# EasyEDA Pro project MultiEffect.eprj

# Schematic BaseBoard
Board Name: BaseBoard; Create Date: 2026-01-03; Page Name: Shematic; Project Name: MultiEffect; Schematic Name: BaseBoard; Update Date: 2026-01-04; Add into BOM: yes; Convert to PCB: yes; Date: 2023-09-30; REV: 1.0; Sheet: 1/1; spicePre: .
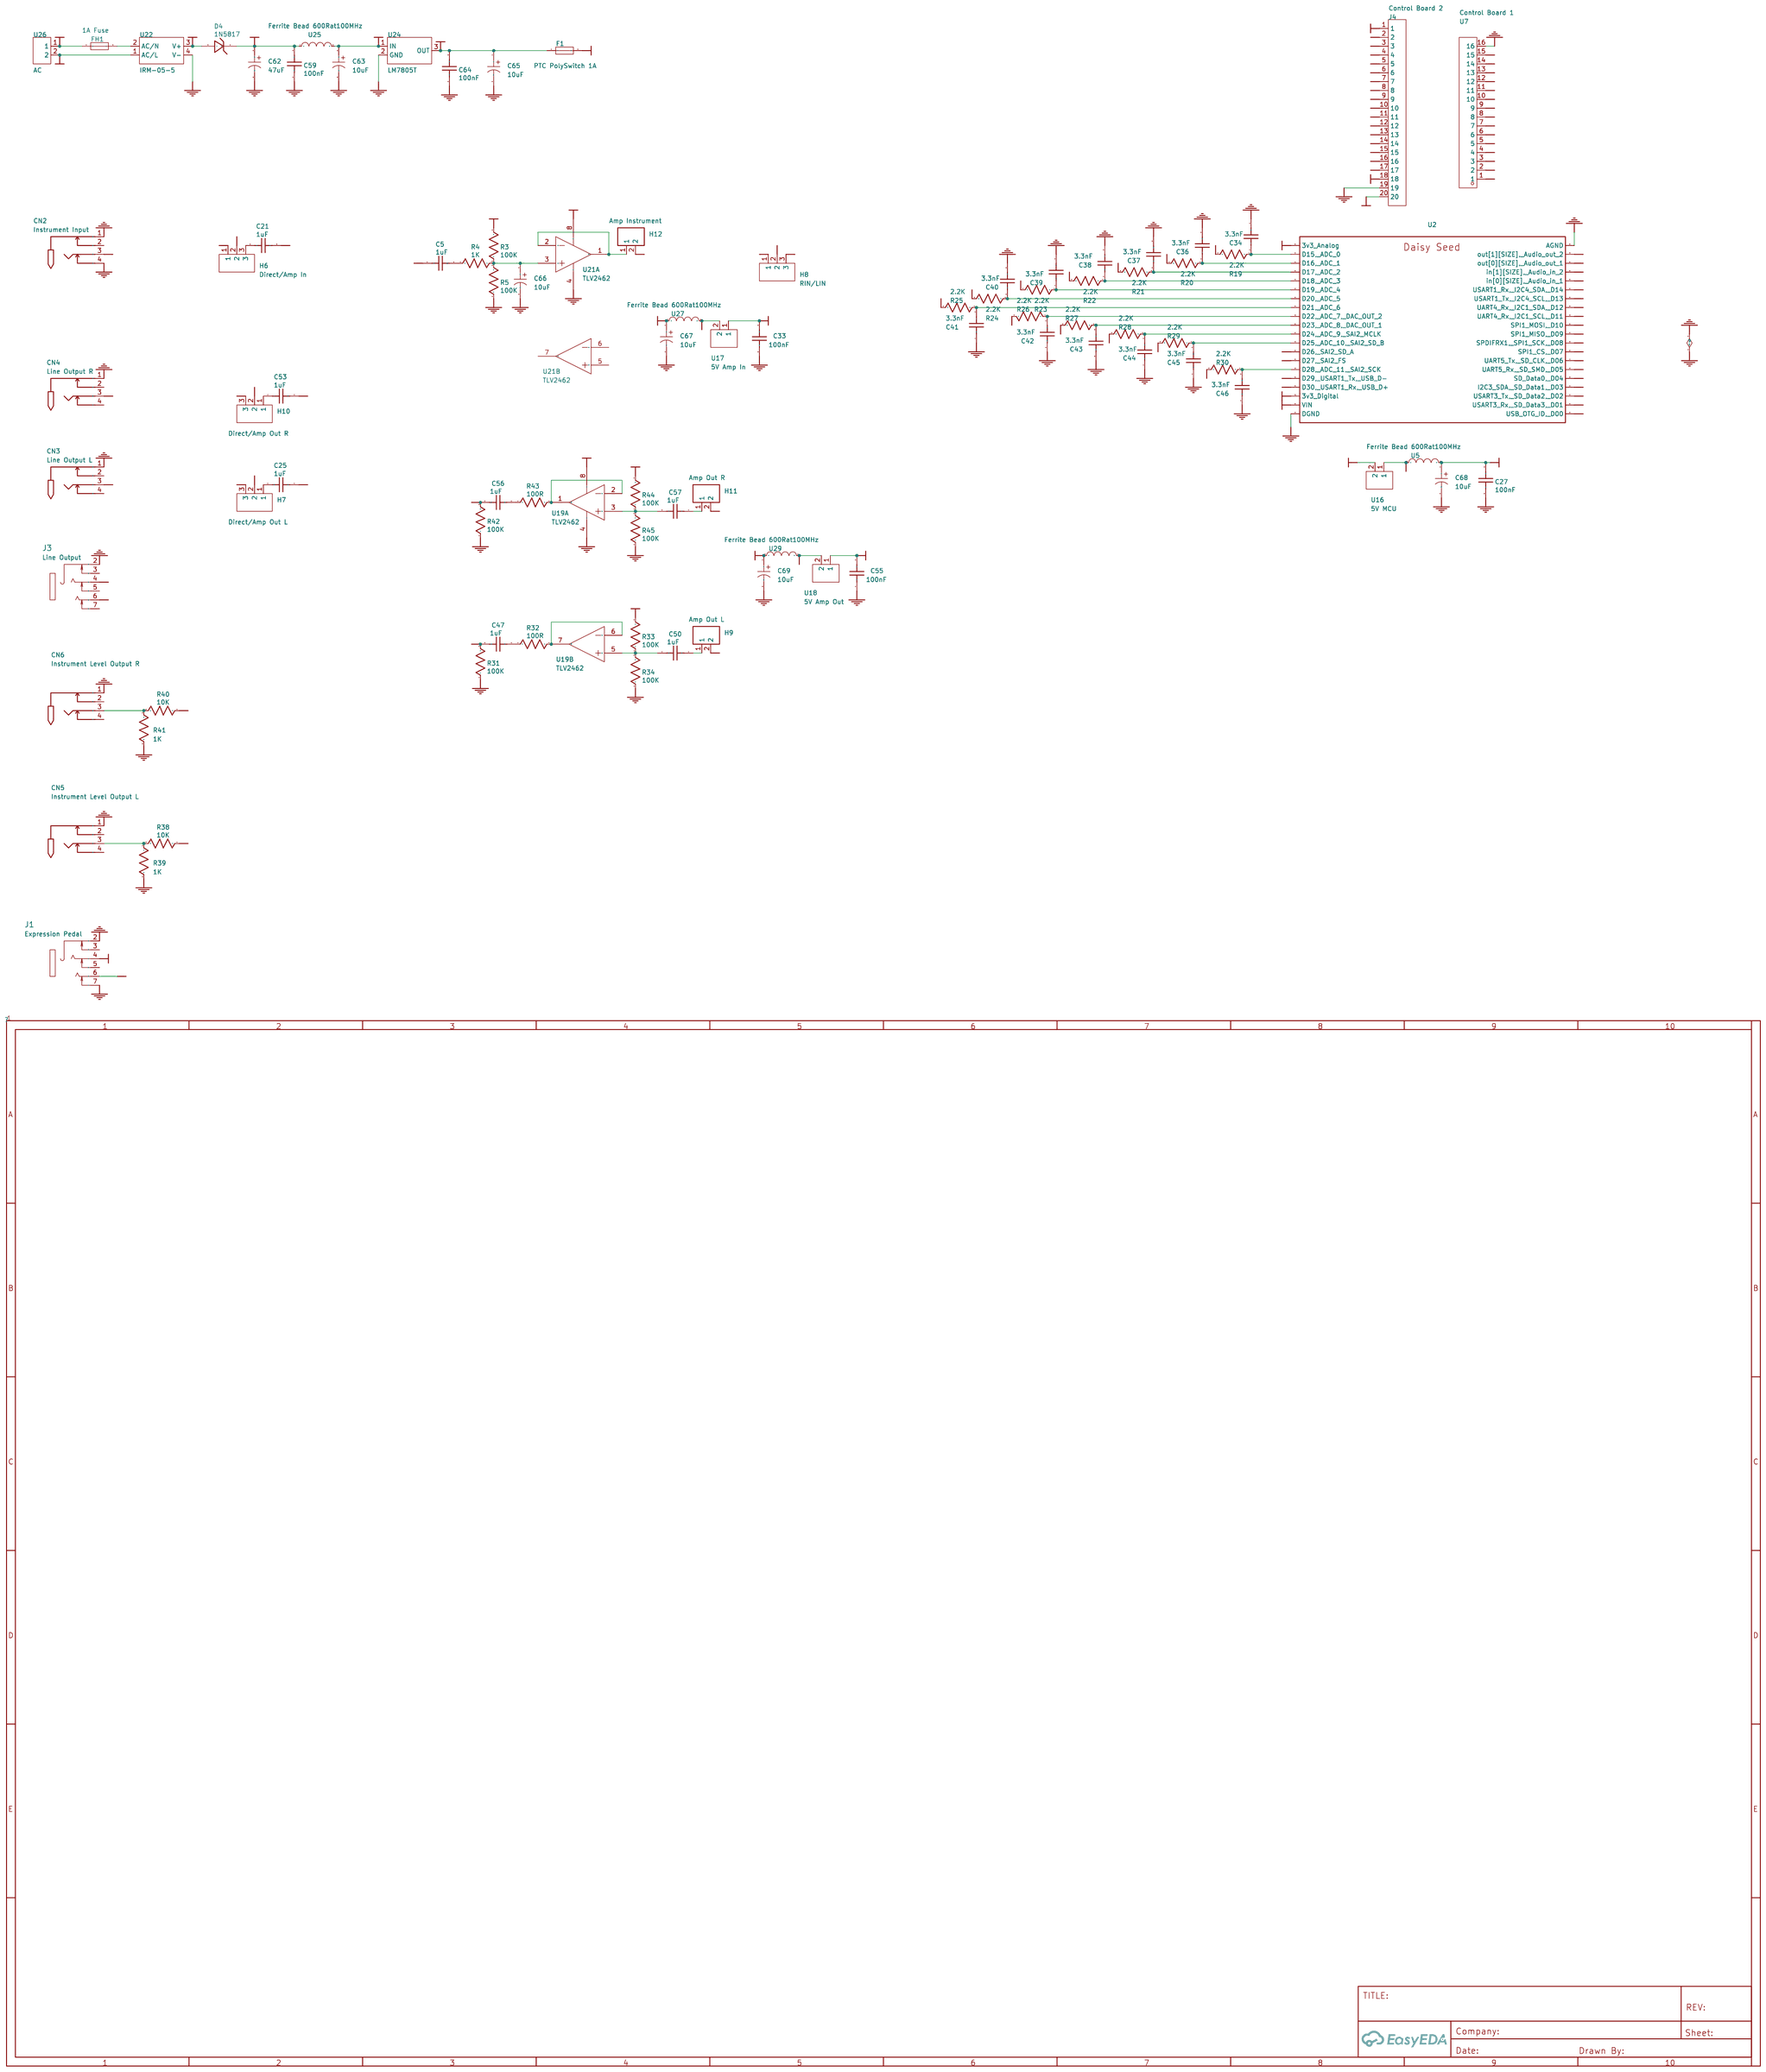
[diagram p0: schematic sheet]

## Parts
C5  1uF  [CAP-TH_L8.0-W4.0-P5.00-D0.7]
C21  1uF  [CAP-TH_L8.0-W4.0-P5.00-D0.7]
C25  1uF  [CAP-TH_L8.0-W4.0-P5.00-D0.7]
C27  100nF  [CAP-TH_L8.0-W4.0-P5.00-D0.7]
C33  100nF  [CAP-TH_L8.0-W4.0-P5.00-D0.7]
C34  3.3nF  [CAP-TH_L8.0-W4.0-P5.00-D0.7]
C36  3.3nF  [CAP-TH_L8.0-W4.0-P5.00-D0.7]
C37  3.3nF  [CAP-TH_L8.0-W4.0-P5.00-D0.7]
C38  3.3nF  [CAP-TH_L8.0-W4.0-P5.00-D0.7]
C39  3.3nF  [CAP-TH_L8.0-W4.0-P5.00-D0.7]
C40  3.3nF  [CAP-TH_L8.0-W4.0-P5.00-D0.7]
C41  3.3nF  [CAP-TH_L8.0-W4.0-P5.00-D0.7]
C42  3.3nF  [CAP-TH_L8.0-W4.0-P5.00-D0.7]
C43  3.3nF  [CAP-TH_L8.0-W4.0-P5.00-D0.7]
C44  3.3nF  [CAP-TH_L8.0-W4.0-P5.00-D0.7]
C45  3.3nF  [CAP-TH_L8.0-W4.0-P5.00-D0.7]
C46  3.3nF  [CAP-TH_L8.0-W4.0-P5.00-D0.7]
C47  1uF  [CAP-TH_L8.0-W4.0-P5.00-D0.7]
C50  1uF  [CAP-TH_L8.0-W4.0-P5.00-D0.7]
C53  1uF  [CAP-TH_L8.0-W4.0-P5.00-D0.7]
C55  100nF  [CAP-TH_L8.0-W4.0-P5.00-D0.7]
C56  1uF  [CAP-TH_L8.0-W4.0-P5.00-D0.7]
C57  1uF  [CAP-TH_L8.0-W4.0-P5.00-D0.7]
C59  100nF  [CAP-TH_L8.0-W4.0-P5.00-D0.7]
C62  47uF  [CAP-TH_BD5.0-P2.00-D0.5-FD]
C63  10uF  [CAP-TH_BD5.0-P2.00-D0.5-FD-1]
C64  100nF  [CAP-TH_L8.0-W4.0-P5.00-D0.7]
C65  10uF  [CAP-TH_BD5.0-P2.00-D0.5-FD-1]
C66  10uF  [CAP-TH_BD5.0-P2.00-D0.5-FD-1]
C67  10uF  [CAP-TH_BD5.0-P2.00-D0.5-FD-1]
C68  10uF  [CAP-TH_BD5.0-P2.00-D0.5-FD-1]
C69  10uF  [CAP-TH_BD5.0-P2.00-D0.5-FD-1]
CN2  Instrument Input  [AUDIO-TH_CK6.35-3-15-6]
CN3  Line Output L  [AUDIO-TH_CK6.35-3-15-6]
CN4  Line Output R  [AUDIO-TH_CK6.35-3-15-6]
CN5  Instrument Level Output L  [AUDIO-TH_CK6.35-3-15-6]
CN6  Instrument Level Output R  [AUDIO-TH_CK6.35-3-15-6]
D4  1N5817  [DO-41_BD2.4-L4.7-P8.70-D0.9-RD]
F1  PTC PolySwitch 1A  [FUSE-TH_BD2.1-L6.5_V0]
FH1  1A Fuse  [FUSE-TH_L24.8-W9.8-P22.60]
H6  Direct/Amp In  [HDR-TH_3P-P2.54-V-M-1]
H7  Direct/Amp Out L  [HDR-TH_3P-P2.54-V-M-1]
H8  RIN/LIN  [HDR-TH_3P-P2.54-V-M-1]
H9  Amp Out L  [HDR-TH_2P-P2.00-V-M]
H10  Direct/Amp Out R  [HDR-TH_3P-P2.54-V-M-1]
H11  Amp Out R  [HDR-TH_2P-P2.00-V-M]
H12  Amp Instrument  [HDR-TH_2P-P2.00-V-M]
J1  Expression Pedal  [AUDIO-TH_PJ-609BA]
J3  Line Output  [AUDIO-TH_PJ-609BA]
J4  Control Board 2  [HDR-TH_20P-P2.54-V-M-1]
R3  100K  [PS-RES-16.5*6.42]
R4  1K  [PS-RES-16.5*6.42]
R5  100K  [PS-RES-16.5*6.42]
R19  2.2K  [PS-RES-16.5*6.42]
R20  2.2K  [PS-RES-16.5*6.42]
R21  2.2K  [PS-RES-16.5*6.42]
R22  2.2K  [PS-RES-16.5*6.42]
R23  2.2K  [PS-RES-16.5*6.42]
R24  2.2K  [PS-RES-16.5*6.42]
R25  2.2K  [PS-RES-16.5*6.42]
R26  2.2K  [PS-RES-16.5*6.42]
R27  2.2K  [PS-RES-16.5*6.42]
R28  2.2K  [PS-RES-16.5*6.42]
R29  2.2K  [PS-RES-16.5*6.42]
R30  2.2K  [PS-RES-16.5*6.42]
R31  100K  [PS-RES-16.5*6.42]
R32  100R  [PS-RES-16.5*6.42]
R33  100K  [PS-RES-16.5*6.42]
R34  100K  [PS-RES-16.5*6.42]
R38  10K  [PS-RES-16.5*6.42]
R39  1K  [PS-RES-16.5*6.42]
R40  10K  [PS-RES-16.5*6.42]
R41  1K  [PS-RES-16.5*6.42]
R42  100K  [PS-RES-16.5*6.42]
R43  100R  [PS-RES-16.5*6.42]
R44  100K  [PS-RES-16.5*6.42]
R45  100K  [PS-RES-16.5*6.42]
U2  Daisy Seed  [DAISY_SEED]
U5  Ferrite Bead 600Rat100MHz  [IND-TH_BD3.5-L6.0-P10.00-D0.8]
U7  Control Board 1  [HDR-TH_16P-P2.54-V-M_1]
U16  5V MCU  [HDR-TH_2P-P2.54-V-M-1]
U17  5V Amp In  [HDR-TH_2P-P2.54-V-M-1]
U18  5V Amp Out  [HDR-TH_2P-P2.54-V-M-1]
U19  TLV2462  [PDIP-8_L9.5-W6.4-P2.54-LS7.6-BL]  (sections 1,2)
U21  TLV2462  [PDIP-8_L9.5-W6.4-P2.54-LS7.6-BL]  (sections 1,2)
U22  IRM-05-5  [PWRM-TH_IRM-05-5]
U24  LM7805T  [TO-220-3_L10.0-W4.5-P2.54-L-1]
U25  Ferrite Bead 600Rat100MHz  [IND-TH_BD3.5-L6.0-P10.00-D0.8]
U26  AC  [CONN-TH_P5.08_KF128-5.08-2P]
U27  Ferrite Bead 600Rat100MHz  [IND-TH_BD3.5-L6.0-P10.00-D0.8]
U29  Ferrite Bead 600Rat100MHz  [IND-TH_BD3.5-L6.0-P10.00-D0.8]

## Library data of the parts
C5 C21 C25 C34 C36-C47 C50 C53 C56 C57 = 1uF: Supplier: LCSC; Supplier Part: C249166; Manufacturer: STE(松田); Manufacturer Part: R08B1B102KN0B0S0N0; JLCPCB Part Class: Extended Part; link: https://lcsc.com/eda_search?q=C249166&%26type=1&ref=editor; nameAlias: Value; Contributor: LCSC; spicePre: C; spiceSymbolName: R08B1B102KN0B0S0N0
C27 C33 C55 C59 C64 = 100nF: Supplier: LCSC; Supplier Part: C249166; Manufacturer: STE(松田); Manufacturer Part: R08B1B102KN0B0S0N0; JLCPCB Part Class: Extended Part; link: https://lcsc.com/eda_search?q=C249166&%26type=1&ref=editor; nameAlias: Value; Contributor: LCSC; spicePre: C; spiceSymbolName: R08B1B102KN0B0S0N0
C62 = FH470M025C110A: LCSC Part Name: 47uF ±20% 25V; Supplier Part: C5129734; Manufacturer: CapXon(丰宾); Supplier Footprint: 插件,D5xL11mm; JLCPCB Part Class: Extended Part; Datasheet: https://item.szlcsc.com/datasheet/FH470M025C110A/5734982.html; Supplier: LCSC; Tolerance: ±20%; Voltage Rating: 25V; Diameter: 5mm; Height - Seated (Max): 11mm; Operating Temperature: -40℃~+105℃
C63 C65-C69 = RD1E106M05011BB180: LCSC Part Name: 10uF ±20% 25V; Supplier Part: C48783599; Manufacturer: SAMWHA(三和); Supplier Footprint: 插件; JLCPCB Part Class: Extended Part; Datasheet: https://item.szlcsc.com/datasheet/RD1E106M05011BB180/51081497.html; Supplier: LCSC; Tolerance: ±20%; Voltage Rating: 25V; Pin Spacing: 2mm; Diameter: 5mm; Height - Seated (Max): 11mm; Operating Temperature: -55℃~+105℃
CN2 = Input: Supplier: LCSC; Supplier Part: C718060; Manufacturer: JINJIA(金佳); Manufacturer Part: CK6.35-3+15-6; JLCPCB Part Class: Extended Part; link: https://lcsc.com/eda_search?q=C718060&%26type=1&ref=editor; Contributor: LCSC; spicePre: C; spiceSymbolName: CK6.35-3+15-6
CN3-CN6 = Output: Supplier: LCSC; Supplier Part: C718060; Manufacturer: JINJIA(金佳); Manufacturer Part: CK6.35-3+15-6; JLCPCB Part Class: Extended Part; link: https://lcsc.com/eda_search?q=C718060&%26type=1&ref=editor; Contributor: LCSC; spicePre: C; spiceSymbolName: CK6.35-3+15-6
D4 = 1N5817: Supplier: LCSC; Supplier Part: C360254; Manufacturer: PINGWEI(平伟); JLCPCB Part Class: Extended Part; Contributor: LCSC; spicePre: D; spiceSymbolName: 1N5817_C360254
F1 = V5: LCSC Part Name: 合金型温度保险丝(轴向型); Supplier Part: C3032520; Manufacturer: SET(赛尔特); Supplier Footprint: 插件,D2.1xL6.5mm; JLCPCB Part Class: Extended Part; Datasheet: https://atta.szlcsc.com/upload/public/pdf/source/20230110/9B5C251F3F537A50CB630C37C16615DD.pdf; Supplier: LCSC; Current Rating: 1A; Voltage Rating: 250V; Rated Functioning Temperature: 135℃; Holding Temperature: 111℃; Operating Temperature: 130℃; Maximum Temperature Limit: 200℃
FH1 = FH1-200CK-B: LCSC Part Name: 两件套 保险丝夹5*20黑色（两件套）; Supplier Part: C268205; Manufacturer: HONGJU(宏聚); Supplier Footprint: 插件; JLCPCB Part Class: Extended Part; Datasheet: https://item.szlcsc.com/datasheet/FH1-200CK-B/257712.html; Supplier: LCSC; Fuseholder Type: Bracket type; Number of Circuits: 1; Voltage Rating: 250V; Current Rating: 10A; Fuse Type: Cylindrical; Fuse Diameter (φD): 5mm; Fuse Length: 20mm
H6-H8 H10 = HX PH254-01-03-Z-L11.5 pcb pin header: Pin Structure:1x3P Pitch:2.54mm Circluar Pins/Square Pins:Pin Header Mounting Type:Through Hole Number of Rows:1 Number of Pins:3P Current Rating:3A Voltage Rating (Max):1kV Length of Mating Pin:6mm Insulation Height:2.5mm Length of End Connection Pin:3mm; LCSC Part Name: 1x3P 间距:2.54mm 方针 直插; Supplier Part: C52016391; Manufacturer: hanxia(韩下); Supplier Footprint: 插件,P=2.54mm; JLCPCB Part Class: Extended Part; Datasheet: https://item.szlcsc.com/datasheet/HX%2520PH254-01-03-Z-L11.5%2520pcb%2520pin%2520header/54760436.html; Supplier: LCSC; Pin Structure: 1x3P; Pitch: 2.54mm; Circluar Pins/Square Pins: Pin Header; Mounting Type: Through Hole; Number of Rows: 1; Number of Pins: 3P; Current Rating: 3A; Voltage Rating (Max): 1kV; Length of Mating Pin: 6mm; Insulation Height: 2.5mm; Length of End Connection Pin: 3mm; Contact Material: Brass; Contact Plating: Gold; Operating Temperature: -40℃~+105℃
H9 H11 H12 = Input Amp: Supplier: LCSC; Supplier Part: C376075; Manufacturer: MINTRON(明硕); Manufacturer Part: MTP220-1102S1; JLCPCB Part Class: Extended Part; link: https://lcsc.com/eda_search?q=C376075&%26type=1&ref=editor; Contributor: LCSC; spicePre: H; spiceSymbolName: MTP220-1102S1
J1 J3 = PJ-609BA: Connector Type:6.35mm Headphone Jack Current Rating:1A Voltage Rating (Max):50V Operating Temperature:-20℃~+70℃ Operating Temperature:-20℃~+70℃; LCSC Part Name: 三件套 6.35mm耳机座; Supplier Part: C309277; Manufacturer: HOOYA(皓宇电子); Supplier Footprint: 插件; JLCPCB Part Class: Extended Part; Datasheet: https://item.szlcsc.com/datasheet/PJ-609BA/292938.html; Supplier: LCSC; Connector Type: 6.35mm Headphone Jack; Current Rating: 1A; Voltage Rating (Max): 50V; Operating Temperature: -20℃~+70℃
J4 = 2.54-1*20P直针: LCSC Part Name: 1x20P 间距:2.54mm 方针 直插; Supplier Part: C50981; Manufacturer: BOOMELE(博穆精密); Supplier Footprint: 插件,P=2.54mm; JLCPCB Part Class: Extended Part; Datasheet: https://item.szlcsc.com/datasheet/2.54-1*20P%25E7%259B%25B4%25E9%2592%2588/51993.html; Supplier: LCSC; Pin Structure: 1x20P; Pitch: 2.54mm; Circluar Pins/Square Pins: Pin Header; Mounting Type: Through Hole; Number of Rows: 1; Number of Pins: 20P; Current Rating: 3A; Contact Material: Brass; Operating Temperature: -40℃~+105℃; Color: Black
R3 R5 R33 R34 R44 R45 = 1M: nameAlias: Value(Ω); Contributor: LCEDA_Lib; spicePre: R; spiceSymbolName: R_0603_US
R4 R38-R41 = 1K: nameAlias: Value(Ω); Contributor: LCEDA_Lib; spicePre: R; spiceSymbolName: R_0603_US
R19-R31 R42 = 100K: nameAlias: Value(Ω); Contributor: LCEDA_Lib; spicePre: R; spiceSymbolName: R_0603_US
R32 R43 = 100R: nameAlias: Value(Ω); Contributor: LCEDA_Lib; spicePre: R; spiceSymbolName: R_0603_US
U2 = Daisy Seed: Contributor: jjmens; spicePre: U
U5 U25 U27 U29 = XRRH3.5*6.0*0.8: Impedance @ Frequency:60Ω@100MHz Number of Circuits:1; LCSC Part Name: 60Ω@100MHz 3.5x6.0x0.8孔磁珠; Supplier Part: C5339819; Manufacturer: XR(祥如); Supplier Footprint: DIP,3.5x6x0.8; JLCPCB Part Class: Extended Part; Datasheet: https://item.szlcsc.com/datasheet/XRRH3.5*6.0*0.8/6109039.html; Supplier: LCSC; Impedance @ Frequency: 60Ω@100MHz; Number of Circuits: 1
U7 = HDGCPH-PZ01-16: Pin Structure:1x16P Pitch:2.54mm Circluar Pins/Square Pins:Pin Header Mounting Type:Through Hole Number of Rows:1 Number of Pins:16P Current Rating:3A Length of Mating Pin:6mm Insulation Height:2.54mm Length of End Connection Pin:3mm Contact Material:Bras; LCSC Part Name: 1x16P 间距:2.54mm 方针 直插; Supplier Part: C19190982; Manufacturer: HDGC(华德共创); Supplier Footprint: 插件,P=2.54mm; JLCPCB Part Class: Extended Part; Datasheet: https://item.szlcsc.com/datasheet/HDGCPH-PZ01-16/20428225.html; Supplier: LCSC; Pin Structure: 1x16P; Pitch: 2.54mm; Circluar Pins/Square Pins: Pin Header; Mounting Type: Through Hole; Number of Rows: 1; Number of Pins: 16P; Current Rating: 3A; Length of Mating Pin: 6mm; Insulation Height: 2.54mm; Length of End Connection Pin: 3mm; Contact Material: Brass; Contact Plating: Gold; Operating Temperature: -40℃~+105℃; Color: Black
U16-U18 = Jumper2: Supplier Part: C2940092; Supplier Footprint: HDR-TH-2P-2.54mm; JLCPCB Part Class: Extended Part; Supplier: LCSC
U19 U21 = TLV2462CP: Number of Channels:2 Maximum Power Supply Range (Vdd-Vss):6V Rail to Rail:Rail-to-Rail Input, Rail-to-Rail Output Gain Bandwidth Product:6.4MHz Vos - Input Offset Voltage:500uV Input Offset Voltage Drift(Vos TC):2uV/℃ Slew Rate:1.6V/us Ib - Input Bias Cur; Supplier Part: C1347707; Manufacturer: TI(德州仪器); Supplier Footprint: PDIP-8; JLCPCB Part Class: Extended Part; Datasheet: https://www.ti.com/cn/lit/gpn/tlv2464; Supplier: LCSC; Number of Channels: 2; Maximum Power Supply Range (Vdd-Vss): 6V; Rail to Rail: Rail-to-Rail Input, Rail-to-Rail Output; Gain Bandwidth Product: 6.4MHz; Vos - Input Offset Voltage: 500uV; Input Offset Voltage Drift(Vos TC): 2uV/℃; Slew Rate: 1.6V/us; Ib - Input Bias Current: 4.4nA; Input Offset Current(Ios): 2.8nA; Noise density(eN): 11nV/√Hz@1kHz; Common Mode Rejection Ratio(CMRR): 85dB; Quiescent Current: 500uA; Output Current: 40mA; Operating Temperature: 0℃~+70℃; Dual Supply: 1.35V~3V；-3V~-1.35V
U22 = IRM-05-5: LCSC Part Name: MW(明纬) 单输出封装型PCB安装型胶囊型绿色模块开关电源 AC-DC 5W IRM-05-5; Supplier Part: C48603696; Manufacturer: null; Supplier Footprint: DIP,45.7x25.4mm; JLCPCB Part Class: Extended Part; Datasheet: https://item.szlcsc.com/datasheet/IRM-05-5/50875454.html; Supplier: LCSC
U24 = LM7805T_C36350857: Output Type:Fixed Voltage - Supply:35V Output Voltage:5V Output Voltage:5V Output Current:1.5A Power Supply Rejection Ratio (PSRR):- Voltage Dropout:2V@(1.0A) Noise:- Operating Temperature:-40℃~+125℃ Operating Temperature:-40℃~+125℃ Output Configuration:P; Supplier Part: C36350857; Manufacturer: HTC; Supplier Footprint: TO-220-3L; JLCPCB Part Class: Extended Part; Datasheet: https://item.szlcsc.com/datasheet/LM7805T/38073495.html; Supplier: LCSC; Output Type: Fixed; Voltage - Supply: 35V; Output Voltage: 5V; Output Current: 1.5A; Voltage Dropout: 2V@(1.0A); Operating Temperature: -40℃~+125℃; Output Configuration: Positive; Number of Outputs: 1
U26 = KF128-5.08-2P-AA: LCSC Part Name: 5.08mm 1x2P 排数:1 每排P数:2 直插; Supplier Part: C474952; Manufacturer: KEFA(科发); Supplier Footprint: 插件,P=5.08mm; JLCPCB Part Class: Extended Part; Datasheet: https://item.szlcsc.com/datasheet/KF128-5.08-2P-AA/481570.html; Supplier: LCSC; Number of Positions or Pins: 1x2P; Pitch: 5.08mm; Color: Green; Mounting Type: Straight; Number of Pins: 2P; Number of Rows: 1; Number of PINs Per Row: 2; Current Rating: 24A; Voltage Rating (Max): 250V; Wire Gauge - AWG: 12~22; Wire Gauge - mm2: 2.5; Operating Temperature: -40℃~+105℃

## Nets
3V3A: J1.4 J4.1 U2.21(3v3 Analog)
3V3D: J4.18 U2.38(3v3 Digital)
5V: C67.1 C69.1 F1.2 J4.20 U16.2 U27.1 U29.1
5VAMPIN: C33.2 R3.2 U17.1 U21.8(V+)
5VAMPOUT: C55.2 R33.2 R44.2 U18.1 U19.8(V+)
5VMCU: C27.2 C68.1 U2.39(VIN) U5.2
5VNOISEY1: U5.1 U16.1
5VNOISEY2: U17.2 U27.2
5VNOISEY3: U18.2 U29.2
5VNOISEY4: C64.2 C65.1 F1.1 U24.3(OUT)
5VUNREG1: D4.2(A) U22.3(V+)
5VUNREG2: C59.2 C62.1 D4.1(C) U25.1
5VUNREG3: C63.1 U24.1(IN) U25.2
AGND: C27.1 C33.1 C34.2 C36.2 C37.2 C38.2 C39.2 C40.2 C41.1 C42.2 C43.1 C44.1 C45.1 C46.1 C55.1 C59.1 C62.2 C63.2 C64.1 C65.2 C66.2 C67.2 C68.2 C69.2 CN2.1 CN2.4 CN3.1 CN4.1 CN5.1 CN6.1 J1.2 J1.7 J3.2 J4.19 R5.1 R31.1 R34.1 R39.2 R41.2 R42.1 R45.1 U2.20(AGND) U2.40(DGND) U7.16 U19.4(V-) U21.4(V-) U22.4(V-) U24.2(GND)
A00: J4.2 R19.2
A01: J4.3 R20.2
A02: J4.4 R21.2
A03: J4.5 R22.2
A04: J4.6 R23.2
A05: J4.7 R24.2
A06: J4.8 R25.2
A07: J4.9 R26.2
A08: J4.10 R27.2
A09: J4.11 R28.2
A10: J4.12 R29.2
A11: J1.6 J4.15 R30.2
AC1: FH1.1 U26.1
AC2: U22.1(AC/L) U26.2
D00: U2.1(USB OTG ID, D00) U7.1
D01: U2.2(USART3 Rx, SD Data3, D01) U7.2
D02: U2.3(USART3 Tx, SD Data2, D02) U7.3
D03: U2.4(I2C3 SDA, SD Data1, D03) U7.4
D04: U2.5(SD Data0, D04) U7.5
D05: U2.6(UART5 Rx, SD SMD, D05) U7.6
D06: U2.7(UART5 Tx, SD CLK, D06) U7.7
D07: U2.8(SPI1 CS, D07) U7.8
D08: U2.9(SPDIFRX1, SPI1 SCK, D08) U7.9
D09: U2.10(SPI1 MISO, D09) U7.10
D10: U2.11(SPI1 MOSI, D10) U7.11
D11: U2.12(UART4 Rx, I2C1 SCL, D11) U7.12
D12: U2.13(UART4 Rx, I2C1 SDA, D12) U7.13
D13: U2.14(USART1 Tx, I2C4 SCL, D13) U7.14
D14: U2.15(USART1 Rx, I2C4 SDA, D14) U7.15
D26: J4.13 U2.33(D26, SAI2 SD A)
D27: J4.14 U2.34(D27, SAI2 FS)
D29: J4.16 U2.36(D29, USART1 Tx, USB D-)
D30: J4.17 U2.37(D30, USART1 Rx, USB D+)
INSIN: CN2.3 H6.2
INSINAMP: C5.1 H6.1
INSINFINAL: C21.2 H8.2 H12.2
LINEINL: H8.1 U2.16(in[0][SIZE], Audio in 1)
LINEINR: H8.3 U2.17(in[1][SIZE], Audio in 2)
LINEOUTL: CN3.3 H7.2 J3.6 R38.1
LINEOUTLAMP: C47.2 H7.3 R31.2
LINEOUTLDIRECT: C25.2 H9.2 U2.18(out[0][SIZE], Audio out 1)
LINEOUTR: CN4.3 H10.2 J3.4 R40.1
LINEOUTRAMP: C56.2 H10.3 R42.2
LINEOUTRDIRECT: C53.2 H11.2 U2.19(out[1][SIZE], Audio out 2)
$1N5814: C5.2 R4.2
$1N5823: C66.1 R3.1 R4.1 R5.2 U21.3(IN A+)
$1N5828: H12.1 U21.1(OUT A) U21.2(IN A-)
$1N7805: C21.1 H6.3
$1N7921: C25.1 H7.1
$1N9193: C34.1 R19.1 U2.22(D15, ADC 0)
$1N14642: C38.1 R22.1 U2.25(D18, ADC 3)
$1N14650: C39.1 R23.1 U2.26(D19, ADC 4)
$1N15099: C45.2 R29.1 U2.32(D25, ADC 10, SAI2 SD B)
$1N15177: C46.2 R30.1 U2.35(D28, ADC 11, SAI2 SCK)
$1N15181: C44.2 R28.1 U2.31(D24, ADC 9, SAI2 MCLK)
$1N15185: C43.2 R27.1 U2.30(D23, ADC 8, DAC OUT 1)
$1N15189: C42.1 R26.1 U2.29(D22, ADC 7, DAC OUT 2)
$1N15193: C41.2 R25.1 U2.28(D21, ADC 6)
$1N15197: C40.1 R24.1 U2.27(D20, ADC 5)
$1N15848: C50.2 R33.1 R34.2 U19.5(IN B+)
$1N15849: R32.2 U19.6(IN B-) U19.7(OUT B)
$1N15860: C50.1 H9.1
$1N16662: C53.1 H10.1
$1N16957: CN5.3 R38.2 R39.1
$1N17083: CN6.3 R40.2 R41.1
$1N18030: C57.1 H11.1
$1N18035: R43.2 U19.1(OUT A) U19.2(IN A-)
$1N18036: C57.2 R44.1 R45.2 U19.3(IN A+)
$1N18270: C56.1 R43.1
$1N18272: C47.1 R32.1
$1N25468: C36.1 R20.1 U2.23(D16, ADC 1)
$1N25490: C37.1 R21.1 U2.24(D17, ADC 2)
$1N29195: FH1.2 U22.2(AC/N)

Not connected (* = marked no-connect by the designer): CN2 2; CN3 2 4; CN4 2 4; CN5 2 4; CN6 2 4; J1 3 5; J3 3 5 7; U21 5(IN B+) 6(IN B-) 7(OUT B)

# Schematic Control
Board Name: Control; Create Date: 2026-01-03; Page Name: Shematic; Project Name: MultiEffect; Schematic Name: Control; Update Date: 2026-01-04; Page Size: A4; Version: V1.0
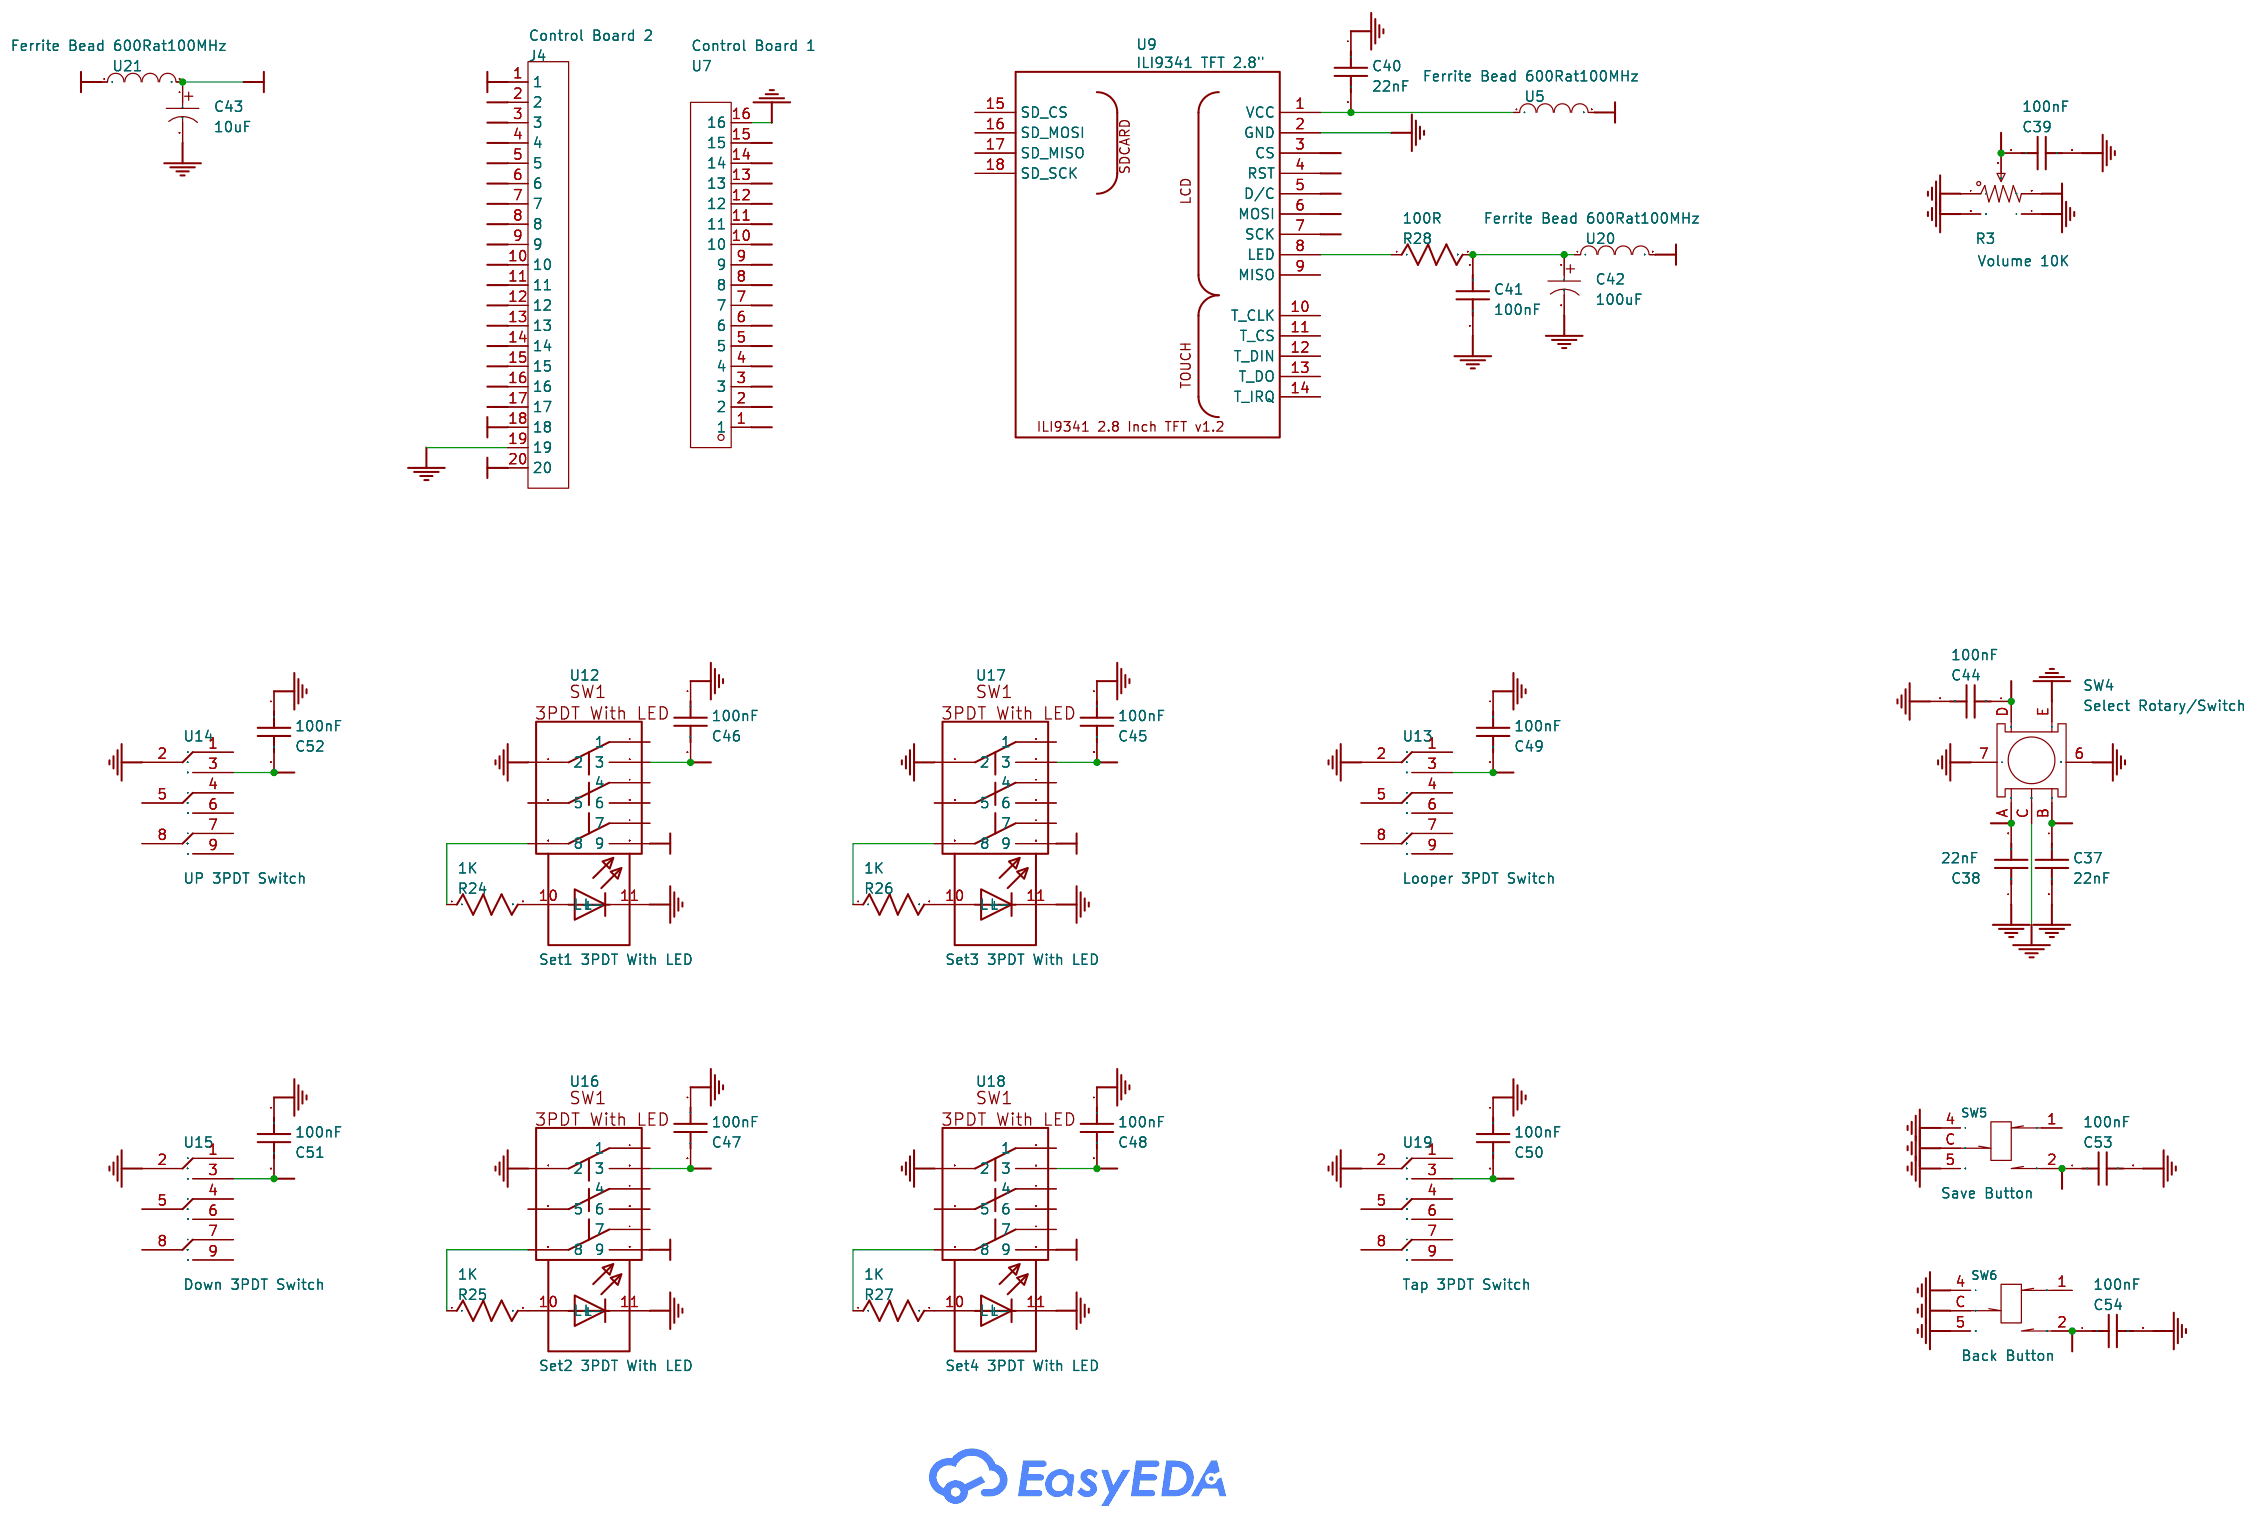
[diagram p1: schematic sheet]

## Parts
C37  22nF  [CAP-TH_L8.0-W4.0-P5.00-D0.7]
C38  22nF  [CAP-TH_L8.0-W4.0-P5.00-D0.7]
C39  100nF  [CAP-TH_L8.0-W4.0-P5.00-D0.7]
C40  22nF  [CAP-TH_L8.0-W4.0-P5.00-D0.7]
C41  100nF  [CAP-TH_L8.0-W4.0-P5.00-D0.7]
C42  100uF  [CAP-TH_BD5.0-P2.00-D0.8-FD]
C43  10uF  [CAP-TH_BD5.0-P2.00-D0.8-FD]
C44  100nF  [CAP-TH_L8.0-W4.0-P5.00-D0.7]
C45  100nF  [CAP-TH_L8.0-W4.0-P5.00-D0.7]
C46  100nF  [CAP-TH_L8.0-W4.0-P5.00-D0.7]
C47  100nF  [CAP-TH_L8.0-W4.0-P5.00-D0.7]
C48  100nF  [CAP-TH_L8.0-W4.0-P5.00-D0.7]
C49  100nF  [CAP-TH_L8.0-W4.0-P5.00-D0.7]
C50  100nF  [CAP-TH_L8.0-W4.0-P5.00-D0.7]
C51  100nF  [CAP-TH_L8.0-W4.0-P5.00-D0.7]
C52  100nF  [CAP-TH_L8.0-W4.0-P5.00-D0.7]
C53  100nF  [CAP-TH_L8.0-W4.0-P5.00-D0.7]
C54  100nF  [CAP-TH_L8.0-W4.0-P5.00-D0.7]
J4  Control Board 2  [HDR-TH_20P-P2.54-V-M-1]
R3  Volume 10K  [RES-ADJ-TH_RK09L1140A5P]
R24  1K  [PS-RES-16.5*6.42]
R25  1K  [PS-RES-16.5*6.42]
R26  1K  [PS-RES-16.5*6.42]
R27  1K  [PS-RES-16.5*6.42]
R28  100R  [PS-RES-16.5*6.42]
SW4  Select Rotary/Switch  [SW-TH_EC11XXXXXXXX]
SW5  Save Button  [SW-TH_SPEF110200]
SW6  Back Button  [SW-TH_SPEF110200]
U5  Ferrite Bead 600Rat100MHz  [IND-TH_BD3.5-L6.0-P10.00-D0.8]
U7  Control Board 1  [HDR-TH_16P-P2.54-V-M_1]
U9  ILI9341 TFT 2.8"  [ILI9341-2.8]
U12  Set1 3PDT With LED  [3PDT With LED]
U13  Looper 3PDT Switch  [3PDT FOOTSWITCH]
U14  UP 3PDT Switch  [3PDT FOOTSWITCH]
U15  Down 3PDT Switch  [3PDT FOOTSWITCH]
U16  Set2 3PDT With LED  [3PDT With LED]
U17  Set3 3PDT With LED  [3PDT With LED]
U18  Set4 3PDT With LED  [3PDT With LED]
U19  Tap 3PDT Switch  [3PDT FOOTSWITCH]
U20  Ferrite Bead 600Rat100MHz  [IND-TH_BD3.5-L6.0-P10.00-D0.8]
U21  Ferrite Bead 600Rat100MHz  [IND-TH_BD3.5-L6.0-P10.00-D0.8]

## Library data of the parts
C37-C41 C44-C54 = 1uF: Supplier: LCSC; Supplier Part: C249166; Manufacturer: STE(松田); Manufacturer Part: R08B1B102KN0B0S0N0; JLCPCB Part Class: Extended Part; link: https://lcsc.com/eda_search?q=C249166&%26type=1&ref=editor; nameAlias: Value; Contributor: LCSC; spicePre: C; spiceSymbolName: R08B1B102KN0B0S0N0
C42 = KS107M016D07RR0VH2FP0: LCSC Part Name: 100uF ±20% 16V; Supplier Part: C43803; Manufacturer: Chengx(承兴); Supplier Footprint: 插件,D5xL7mm; JLCPCB Part Class: Extended Part; Datasheet: https://item.szlcsc.com/datasheet/KS107M016D07RR0VH2FP0/44805.html; Supplier: LCSC; Tolerance: ±20%; Voltage Rating: 16V; Pin Spacing: 2mm; Diameter: 5mm; Height - Seated (Max): 7mm; Lifetime: 1000hrs@105℃; Operating Temperature: -40℃~+105℃
C43 = KM106M016D11RR0VH2FP0: LCSC Part Name: 10uF ±20% 16V; Supplier Part: C43799; Manufacturer: Chengx(承兴); Supplier Footprint: 插件,D5xL11mm; JLCPCB Part Class: Extended Part; Datasheet: https://item.szlcsc.com/datasheet/KM106M016D11RR0VH2FP0/44801.html; Supplier: LCSC; Tolerance: ±20%; Voltage Rating: 16V; Ripple Current: 35mA@120Hz; Pin Spacing: 2mm; Diameter: 5mm; Height - Seated (Max): 11mm; Lifetime: 1000hrs@105℃
J4 = 2.54-1*20P直针: LCSC Part Name: 1x20P 间距:2.54mm 方针 直插; Supplier Part: C50981; Manufacturer: BOOMELE(博穆精密); Supplier Footprint: 插件,P=2.54mm; JLCPCB Part Class: Extended Part; Datasheet: https://item.szlcsc.com/datasheet/2.54-1*20P%25E7%259B%25B4%25E9%2592%2588/51993.html; Supplier: LCSC; Pin Structure: 1x20P; Pitch: 2.54mm; Circluar Pins/Square Pins: Pin Header; Mounting Type: Through Hole; Number of Rows: 1; Number of Pins: 20P; Current Rating: 3A; Contact Material: Brass; Operating Temperature: -40℃~+105℃; Color: Black
R3 = RK09L114001T: Resistance: Tolerance:±20% Tolerance:±20% Rated Voltage: Power(Watts):50mW Turns:-; LCSC Part Name: 10kΩ ±20%; Supplier Part: C470463; Manufacturer: ALPSALPINE(阿尔卑斯阿尔派); Supplier Footprint: 插件; JLCPCB Part Class: Extended Part; Datasheet: https://atta.szlcsc.com/upload/public/pdf/source/20191216/C470489_E36F9C6EE0CCD2AF3E5C837DE947D32B.pdf; Supplier: LCSC; Tolerance: ±20%; Power(Watts): 50mW
R24-R28 = 100K: nameAlias: Value(Ω); Contributor: LCEDA_Lib; spicePre: R; spiceSymbolName: R_0603_US
SW4 = EC11E15244B2_C470754: LCSC Part Name: EC11E15244B2; Supplier Part: C470754; Manufacturer: ALPSALPINE(阿尔卑斯阿尔派); Supplier Footprint: 插件; JLCPCB Part Class: Extended Part; Datasheet: https://atta.szlcsc.com/upload/public/pdf/source/20191216/C470795_DE763ECE59BD49533DB26DB53E5D34B2.pdf; Supplier: LCSC
SW5 SW6 = SPEF110200: LCSC Part Name: 9.4*9*14.6mm 直插 轻触开关; Supplier Part: C388861; Manufacturer: ALPSALPINE(阿尔卑斯阿尔派); Supplier Footprint: 插件,9.4x9mm; JLCPCB Part Class: Extended Part; Datasheet: https://item.szlcsc.com/datasheet/SPEF110200/364169.html; Supplier: LCSC; Circuit: SPDT; Actuator Style: Rectangular Button; Mounting Type: Through Hole; Length: 9.4mm; Width: 9mm; Switch Height: 14.6mm; Contact Current: 1A; Voltage Rating: 14.5V
U5 U20 U21 = XRRH3.5*6.0*0.8: Impedance @ Frequency:60Ω@100MHz Number of Circuits:1; LCSC Part Name: 60Ω@100MHz 3.5x6.0x0.8孔磁珠; Supplier Part: C5339819; Manufacturer: XR(祥如); Supplier Footprint: DIP,3.5x6x0.8; JLCPCB Part Class: Extended Part; Datasheet: https://item.szlcsc.com/datasheet/XRRH3.5*6.0*0.8/6109039.html; Supplier: LCSC; Impedance @ Frequency: 60Ω@100MHz; Number of Circuits: 1
U7 = HDGCPH-PZ01-16: Pin Structure:1x16P Pitch:2.54mm Circluar Pins/Square Pins:Pin Header Mounting Type:Through Hole Number of Rows:1 Number of Pins:16P Current Rating:3A Length of Mating Pin:6mm Insulation Height:2.54mm Length of End Connection Pin:3mm Contact Material:Bras; LCSC Part Name: 1x16P 间距:2.54mm 方针 直插; Supplier Part: C19190982; Manufacturer: HDGC(华德共创); Supplier Footprint: 插件,P=2.54mm; JLCPCB Part Class: Extended Part; Datasheet: https://item.szlcsc.com/datasheet/HDGCPH-PZ01-16/20428225.html; Supplier: LCSC; Pin Structure: 1x16P; Pitch: 2.54mm; Circluar Pins/Square Pins: Pin Header; Mounting Type: Through Hole; Number of Rows: 1; Number of Pins: 16P; Current Rating: 3A; Length of Mating Pin: 6mm; Insulation Height: 2.54mm; Length of End Connection Pin: 3mm; Contact Material: Brass; Contact Plating: Gold; Operating Temperature: -40℃~+105℃; Color: Black
U9 = ILI9341 TFT 2.8": spicePre: X; Contributor: Alex_zidat
U12 U16-U18 = 3PDT With LED: Manufacturer: Daier; Manufacturer Part: PBS-24-302-N1-PON-ON; link: https://www.chinadaier.com/pbs-24-302-n1-on-on-single-color-led-footswitch/
U13-U15 U19 = 3PDT

## Nets
3V3A: J4.1 R3.3
3V3D: J4.18 U5.2
5V: J4.20 U20.2 U21.1
5VLED: C43.1 U12.9 U16.9 U17.9 U18.9 U21.2
AGND: C39.2 R3.1 R3.4 R3.5 SW4.6 SW4.7 SW5.4 SW5.5 SW6.4 SW6.5 U7.16
DGND: C37.2 C38.1 C40.1 C41.2 C42.2 C43.2 C44.2 C45.1 C46.1 C47.1 C48.1 C49.1 C50.1 C51.1 C52.1 C53.2 C54.2 J4.19 SW4.C SW4.E SW5.C SW6.C U9.2(GND) U12.2 U12.11(L-) U13.2 U14.2 U15.2 U16.2 U16.11(L-) U17.2 U17.11(L-) U18.2 U18.11(L-) U19.2
A00: C39.1 J4.2 R3.2
A01: J4.3
A02: J4.4
A03: J4.5
A04: J4.6
A05: J4.7
A06: J4.8
A07: J4.9
A08: J4.10
A09: J4.11
A10: J4.12
A11: J4.15
D00: C37.1 C38.2 C44.1 C45.2 C46.2 C47.2 C48.2 C49.2 C50.2 C51.2 C52.2 C53.1 C54.1 SW4.A SW4.B SW4.D SW5.2 SW6.2 U7.1 U12.3 U13.3 U14.3 U15.3 U16.3 U17.3 U18.3 U19.3
D01: U7.2
D02: U7.3
D03: U7.4
D04: U7.5
D05: U7.6
D06: U7.7 U9.5(D/C)
D07: U7.8 U9.3(CS)
D08: U7.9 U9.7(SCK)
D09: U7.10 U9.4(RST)
D10: U7.11 U9.6(MOSI)
D11: U7.12
D12: U7.13
D13: U7.14
D14: U7.15
D26: J4.13
D27: J4.14
D29: J4.16
D30: J4.17
$1N8378: R25.2 U16.10(L+)
$1N8379: R25.1 U16.8
$1N8381: R24.2 U12.10(L+)
$1N8382: R24.1 U12.8
$1N8592: R27.2 U18.10(L+)
$1N8593: R27.1 U18.8
$1N8595: R26.2 U17.10(L+)
$1N8596: R26.1 U17.8
$1N9887: R28.1 U9.8(LED)
$1N9891: C41.1 C42.1 R28.2 U20.1
$1N9940: C40.2 U5.1 U9.1(VCC)

Not connected (* = marked no-connect by the designer): SW5 1; SW6 1; U9 9(MISO) 10(T_CLK) 11(T_CS) 12(T_DIN) 13(T_DO) 14(T_IRQ) 15(SD_CS) 16(SD_MOSI) 17(SD_MISO) 18(SD_SCK); U12 1 4 5 6 7; U13 1 4 5 6 7 8 9; U14 1 4 5 6 7 8 9; U15 1 4 5 6 7 8 9; U16 1 4 5 6 7; U17 1 4 5 6 7; U18 1 4 5 6 7; U19 1 4 5 6 7 8 9

# Board Control
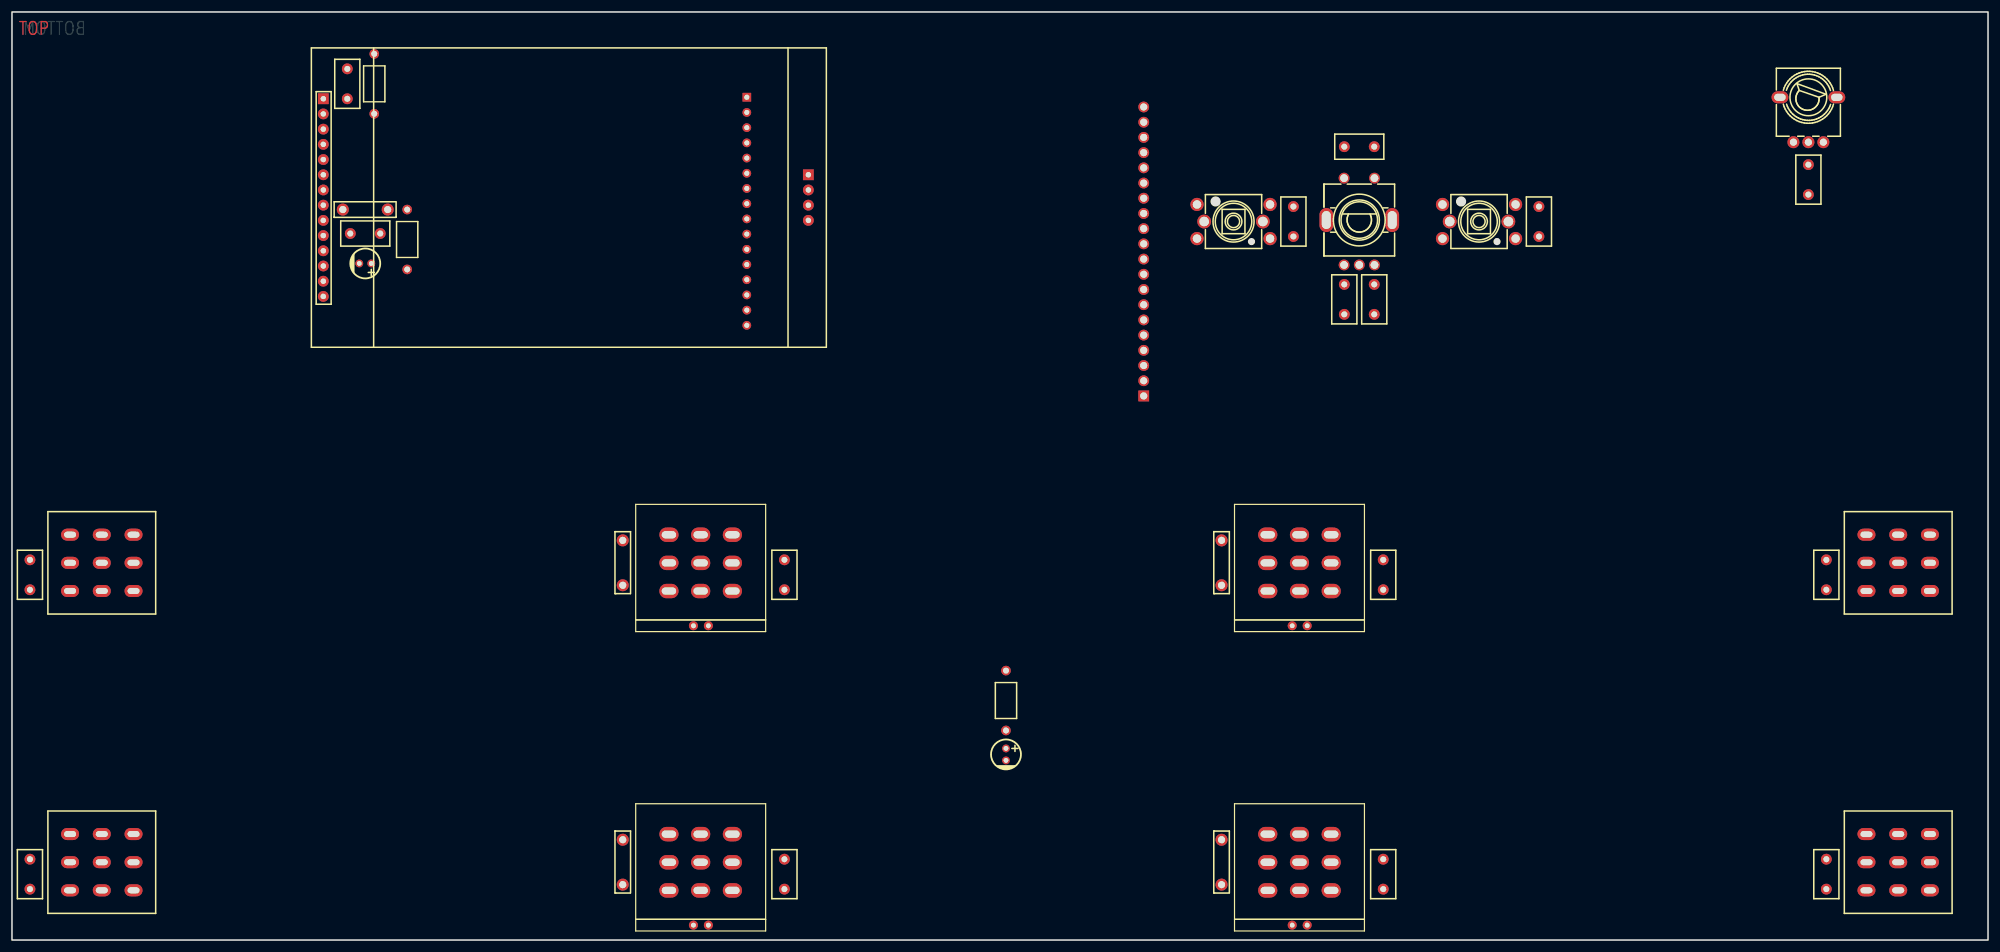
[diagram p2: board, top side]
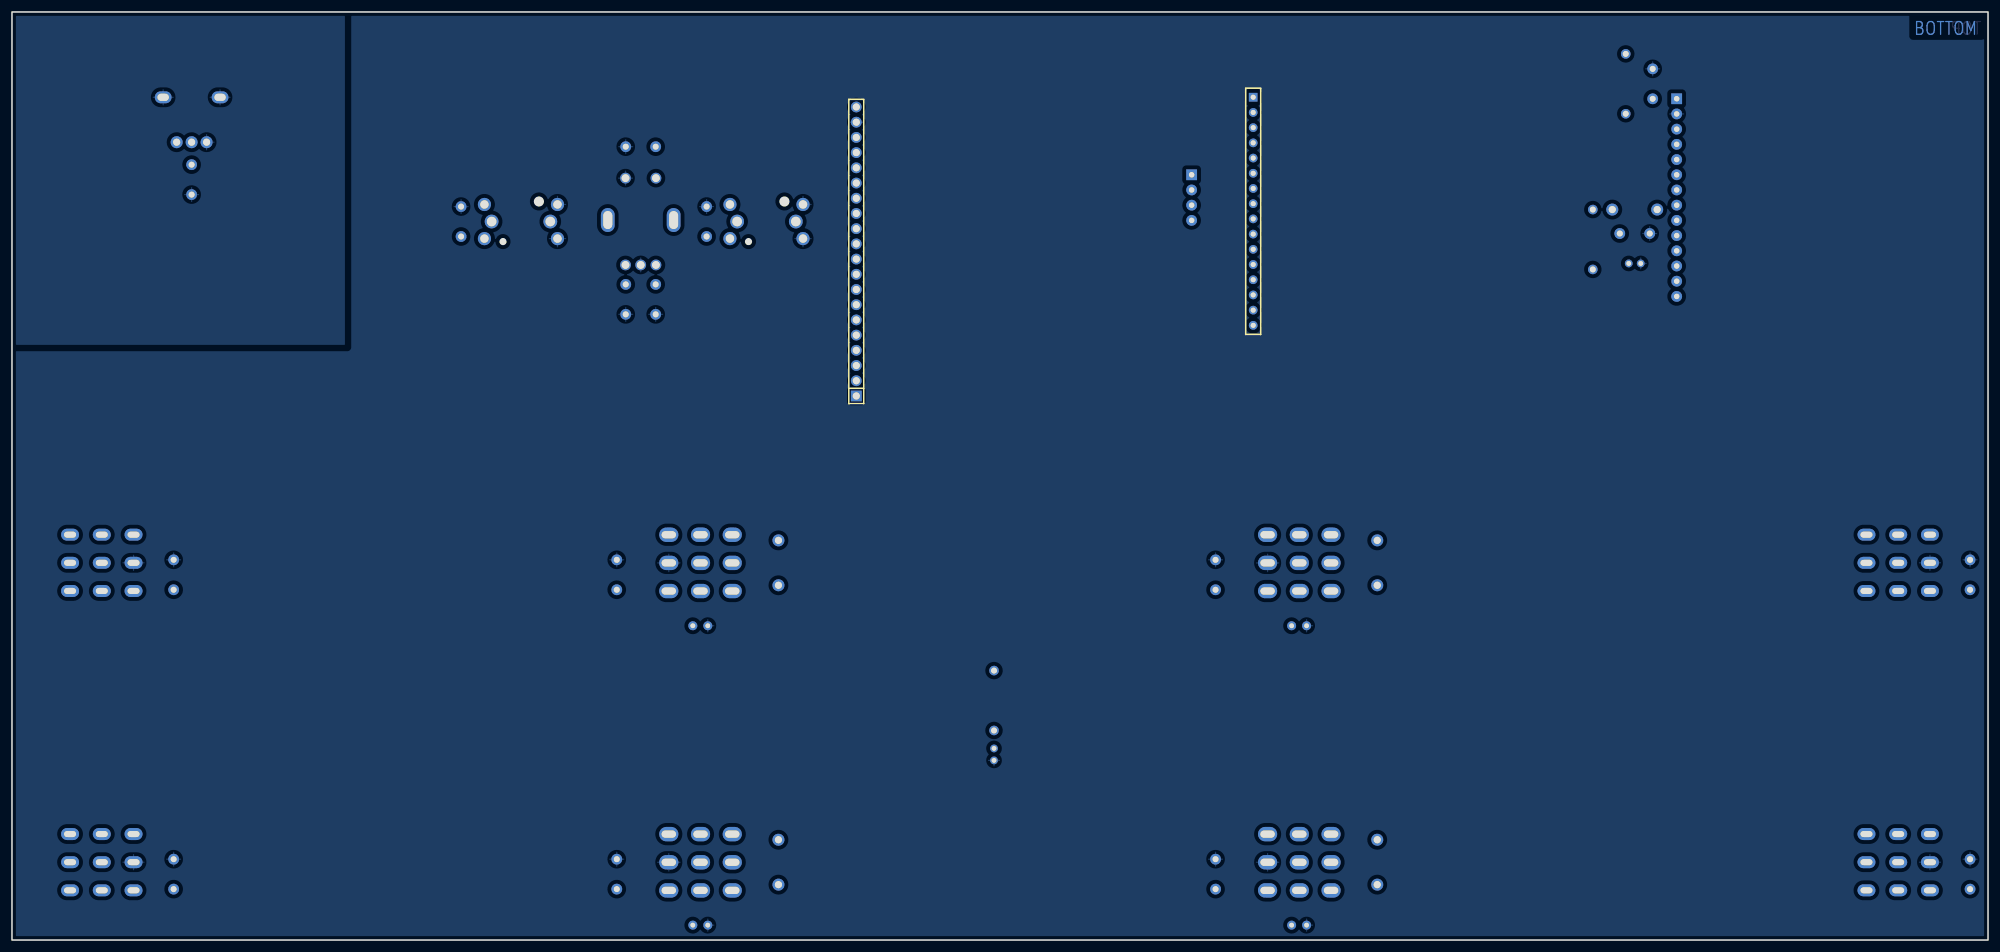
[diagram p3: board, bottom side, seen from below]

Outline 330 x 155 mm; copper layers: Top Layer, Bottom Layer. Coordinates in mm from the lower left corner of the outline.
Outline path: rectangle 0,155 330,0
Stack: Top Layer 0.035mm / Dielectric1 1.51mm FR4 er 4.5 / Bottom Layer 0.035mm

## Design rules (mm)
template: JLCPCB Capability(Two Layers Board)
spacing copperThickness1oz (default): track to track 0.102, other pairs 0.152 to 0.3
spacing copperThickness2oz: track to track 0.203, other pairs 0.152 to 0.3
track width copperThickness1oz (default): min 0.127, default 0.254, max 2.54
track width copperThickness2oz: min 0.203, default 0.254, max 2.54
differential pair differentialPair (default): width min 0.127, default 0.254, max 2.54; gap min 0.152, default 0.152
via viaSize (default): diameter min 0.5, default 0.61, max 10; hole min 0.3, default 0.305, max 6.3

## Placement (name value [footprint] x y rotation side)
C37  22nF  [CAP-TH_L8.0-W4.0-P5.00-D0.7]  227.5 107 270 top
C38  22nF  [CAP-TH_L8.0-W4.0-P5.00-D0.7]  222.5 107 90 top
C39  100nF  [CAP-TH_L8.0-W4.0-P5.00-D0.7]  300 127 270 top
C40  22nF  [CAP-TH_L8.0-W4.0-P5.00-D0.7]  56 143 270 top
C41  100nF  [CAP-TH_L8.0-W4.0-P5.00-D0.7]  59 118 180 top
C42  100uF  [CAP-TH_BD5.0-P2.00-D0.8-FD]  59 113 180 top
C43  10uF  [CAP-TH_BD5.0-P2.00-D0.8-FD]  166 31 270 top
C44  100nF  [CAP-TH_L8.0-W4.0-P5.00-D0.7]  225 132.5 0 top
C45  100nF  [CAP-TH_L8.0-W4.0-P5.00-D0.7]  229 61 270 top
C46  100nF  [CAP-TH_L8.0-W4.0-P5.00-D0.7]  129 61 270 top
C47  100nF  [CAP-TH_L8.0-W4.0-P5.00-D0.7]  129 11 270 top
C48  100nF  [CAP-TH_L8.0-W4.0-P5.00-D0.7]  229 11 270 top
C49  100nF  [CAP-TH_L8.0-W4.0-P5.00-D0.7]  303 61 270 top
C50  100nF  [CAP-TH_L8.0-W4.0-P5.00-D0.7]  303 11 270 top
C51  100nF  [CAP-TH_L8.0-W4.0-P5.00-D0.7]  3 11 270 top
C52  100nF  [CAP-TH_L8.0-W4.0-P5.00-D0.7]  3 61 270 top
C53  100nF  [CAP-TH_L8.0-W4.0-P5.00-D0.7]  214 120 90 top
C54  100nF  [CAP-TH_L8.0-W4.0-P5.00-D0.7]  255 120 90 top
J4  Control Board 2  [HDR-TH_20P-P2.54-V-M-1]  189 115 90 bottom
R3  Volume 10K  [RES-ADJ-TH_RK09L1140A5P]  300 137 0 top
R24  1K  [PS-RES-16.5*6.42]  102 63 270 top
R25  1K  [PS-RES-16.5*6.42]  102 13 270 top
R26  1K  [PS-RES-16.5*6.42]  202 63 270 top
R27  1K  [PS-RES-16.5*6.42]  202 13 270 top
R28  100R  [PS-RES-16.5*6.42]  59 122 0 top
SW4  Select Rotary/Switch  [SW-TH_EC11XXXXXXXX]  225 120 0 top
SW5  Save Button  [SW-TH_SPEF110200]  204 120 0 top
SW6  Back Button  [SW-TH_SPEF110200]  245 120 0 top
U5  Ferrite Bead 600Rat100MHz  [IND-TH_BD3.5-L6.0-P10.00-D0.8]  60.5 143 90 top
U7  Control Board 1  [HDR-TH_16P-P2.54-V-M_1]  122.72 121.71 270 bottom
U9  ILI9341 TFT 2.8"  [ILI9341-2.8]  50 149 180 top
U12  Set1 3PDT With LED  [3PDT With LED]  115 63 0 top
U13  Looper 3PDT Switch  [3PDT FOOTSWITCH]  315 63 0 top
U14  UP 3PDT Switch  [3PDT FOOTSWITCH]  15 63 0 top
U15  Down 3PDT Switch  [3PDT FOOTSWITCH]  15 13 0 top
U16  Set2 3PDT With LED  [3PDT With LED]  115 13 0 top
U17  Set3 3PDT With LED  [3PDT With LED]  215 63 0 top
U18  Set4 3PDT With LED  [3PDT With LED]  215 13 0 top
U19  Tap 3PDT Switch  [3PDT FOOTSWITCH]  315 13 0 top
U20  Ferrite Bead 600Rat100MHz  [IND-TH_BD3.5-L6.0-P10.00-D0.8]  66 117 270 top
U21  Ferrite Bead 600Rat100MHz  [IND-TH_BD3.5-L6.0-P10.00-D0.8]  166 40 270 top

## Footprints (pads in the part's own frame, mm; a bottom-side part is the same pattern mirrored in y, then rotated)
3PDT FOOTSWITCH
  oval 3x2 hole 2x1: 1(-5.3,4.7) 2(-5.3,0) 3(-5.3,-4.7) 4(0,4.7) 5(0,0) 6(0,-4.7) 7(5.3,4.7) 8(5.3,0) 9(5.3,-4.7)
3PDT With LED
  oval 3.2x2.4 hole 2.4x1.2: 1(5.312,4.688) 2(5.312,-0.013) 3(5.312,-4.713) 4(0.013,4.688) 5(0.013,-0.013) 6(0.013,-4.713) 7(-5.287,4.688) 8(-5.287,-0.013) 9(-5.287,-4.713)
  oval 1.5x1.5 hole 0.8x0.805: 10(1.3,-10.512) 11(-1.2,-10.512)
CAP-TH_BD5.0-P2.00-D0.8-FD
  round 1.3 hole 0.8: 1(-1,0) 2(1,0)
CAP-TH_L8.0-W4.0-P5.00-D0.7
  round 1.8 hole 1: 1(-2.5,0) 2(2.5,0)
HDR-TH_16P-P2.54-V-M_1
  rect 1.45x1.45 hole 0.85: 1(-19.05,0)
  round 1.45 hole 0.85: 2(-16.51,0) 3(-13.97,0) 4(-11.43,0) 5(-8.89,0) 6(-6.35,0) 7(-3.81,0) 8(-1.27,0) 9(1.27,0) 10(3.81,0) 11(6.35,0) 12(8.89,0) 13(11.43,0) 14(13.97,0) 15(16.51,0) 16(19.05,0)
HDR-TH_20P-P2.54-V-M-1
  rect 1.8x1.8 hole 1.2: 1(-24.13,0)
  round 1.8 hole 1.2: 2(-21.59,0) 3(-19.05,0) 4(-16.51,0) 5(-13.97,0) 6(-11.43,0) 7(-8.89,0) 8(-6.35,0) 9(-3.81,0) 10(-1.27,0) 11(1.27,0) 12(3.81,0) 13(6.35,0) 14(8.89,0) 15(11.43,0) 16(13.97,0) 17(16.51,0) 18(19.05,0) 19(21.59,0) 20(24.13,0)
ILI9341-2.8
  rect 1.8x1.8 hole 0.905x0.9: 1(-1.996,8.489) 15(-82.997,21.189)
  round 1.8 hole 0.905x0.9: 2(-1.994,11.028) 3(-1.994,13.569) 4(-1.994,16.108) 5(-1.994,18.648) 6(-1.994,21.189) 7(-1.994,23.729) 8(-1.994,26.266) 9(-1.994,28.806) 10(-1.994,31.346) 11(-1.994,33.886) 12(-1.994,36.426) 13(-1.994,38.966) 14(-1.994,41.506) 16(-82.997,23.729) 17(-82.997,26.266) 18(-82.997,28.806)
IND-TH_BD3.5-L6.0-P10.00-D0.8
  round 1.6 hole 1: 1(-5,0) 2(5,0)
PS-RES-16.5*6.42
  round 2 hole 1.2: 1(-3.749,0) 2(3.749,0)
RES-ADJ-TH_RK09L1140A5P
  round 2 hole 1.2: 1(-2.5,-3.75) 2(0,-3.75) 3(2.5,-3.75)
  oval 2.8x2 hole 1.9x1.2: 4(4.75,3.75) 5(-4.75,3.75)
SW-TH_EC11XXXXXXXX
  oval 2.3x4 hole 1.5x3: 6(5.5,0.25) 7(-5.5,0.25)
  round 1.8 hole 1.3: A(-2.54,-7.25) B(2.54,-7.25) C(0,-7.25) D(-2.54,7.25) E(2.54,7.25)
SW-TH_SPEF110200
  round 2.2 hole 1.4: 1(6.1,2.85) 2(6.1,-2.85) C(-6.1,2.85) C(-6.1,-2.85)
  round 2.3 hole 1.6: 4(-4.9,0) 5(4.9,0)

## Nets
As in the schematic.

Pads without a net: SW5 1; SW6 1; U9 9 10 11 12 13 14 15 16 17 18; U12 1 4 5 6 7; U13 1 4 5 6 7 8 9; U14 1 4 5 6 7 8 9; U15 1 4 5 6 7 8 9; U16 1 4 5 6 7; U17 1 4 5 6 7; U18 1 4 5 6 7; U19 1 4 5 6 7 8 9

## Copper pours and planes (outline as drawn; the poured copper is in the pictures)
AGND on Bottom Layer: 274,155 330,155 330,99 274,99
DGND on Bottom Layer: 0,155 330,155 330,0 0,0

## Text on the board
Bottom Layer: BOTTOM
Top Layer: TOP

# Board BaseBoard
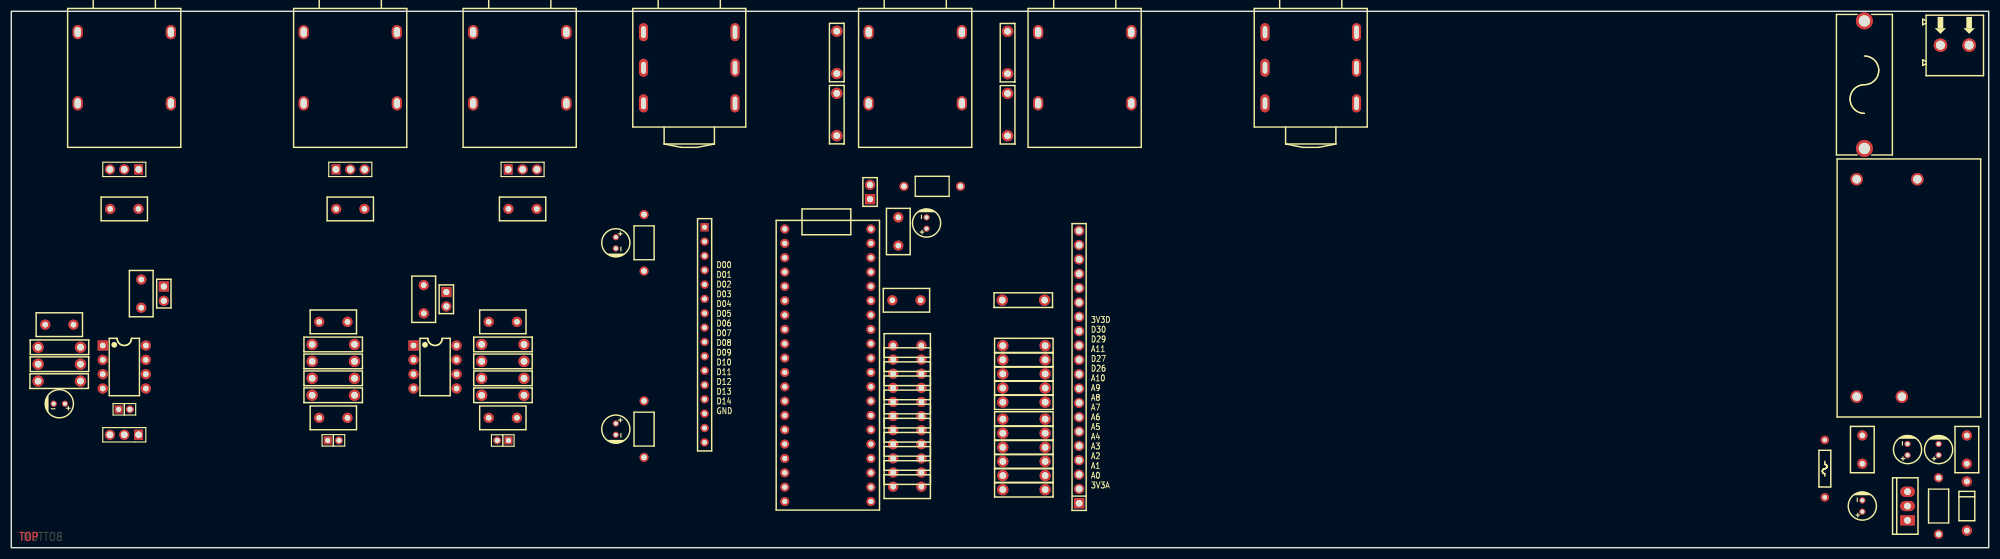
[diagram p4: board, top side]
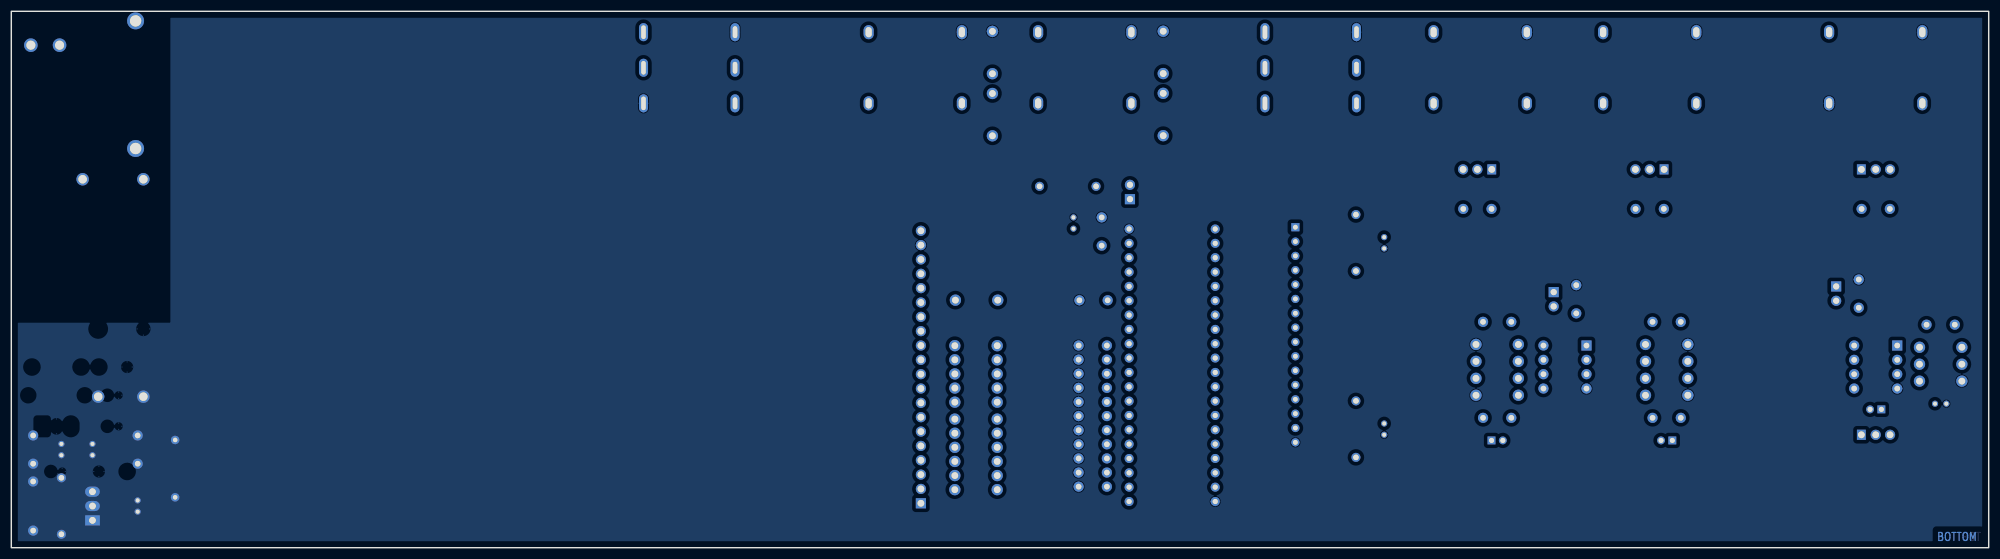
[diagram p5: board, bottom side, seen from below]

Outline 350 x 95 mm; copper layers: Top Layer, Bottom Layer. Coordinates in mm from the lower left corner of the outline.
Outline path: rectangle 0,95 350,0
Stack: Top Layer 0.035mm / Dielectric1 1.51mm FR4 er 4.5 / Bottom Layer 0.035mm

## Design rules (mm)
net 5V: V5
net LINEINR: Analogs
net LINEINL: Analogs
net LINEOUTR: Analogs
net LINEOUTL: Analogs
net D02: Digitals
net D00: Digitals
net D01: Digitals
net D03: Digitals
net D04: Digitals
net D05: Digitals
net D06: Digitals
net D07: Digitals
net D08: Digitals
net D09: Digitals
net D10: Digitals
net D11: Digitals
net D12: Digitals
net D13: Digitals
net D14: Digitals
net 3V3A: Analogs
net D26: Digitals
net D27: Digitals
net D29: Digitals
net D30: Digitals
net 3V3D: Digitals
net A00: Analogs
net A01: Analogs
net A02: Analogs
net A03: Analogs
net A04: Analogs
net A05: Analogs
net A06: Analogs
net A07: Analogs
net A08: Analogs
net A09: Analogs
net A10: Analogs
net A11: Analogs
net LINEOUTLDIRECT: Analogs
net LINEOUTLAMP: Analogs
net LINEOUTRDIRECT: Analogs
net 5VMCU: V5
net LINEOUTRAMP: Analogs
net 5VAMPIN: V5
net 5VAMPOUT: V5
net INSINAMP: Analogs
net INSINFINAL: Analogs
net INSIN: Analogs
net 5VUNREG2: V5
net 5VUNREG3: V5
net 5VUNREG1: V5
net AC2: AC
net AC1: AC
net 5VNOISEY2: V5
net 5VNOISEY3: V5
net 5VNOISEY1: V5
net 5VNOISEY4: V5
template: User Custom Config
spacing Default (default): track to track 0.2, other pairs 0 to 0.2
spacing Analog-Digital: track to track 1, other pairs 0.152 to 1
track width Default (default): min 0.1, default 0.1, max 0.1
track width Voltage: min 0.5, default 0.5, max 0.5
track width MCUVoltage: min 0.15, default 0.15, max 0.15
track width Digital: min 0.1, default 0.1, max 0.1
track width Analog: min 0.1, default 0.1, max 0.1
track width AC: min 1, default 1, max 1
differential pair differentialPair (default): width min 0.127, default 0.254, max 2.54; gap min 0.152, default 0.152
via Default (default): diameter min 1, default 1, max 100.025; hole min 0.5, default 0.5, max 59.995
via Voltage: diameter min 1, default 1, max 1; hole min 0.5, default 0.5, max 0.5
net class V5 uses Voltage
net class Analogs uses Analog, Analog-Digital
net class Digitals uses Analog-Digital, Digital
net class AC uses AC
net 5V uses Voltage
net LINEINR uses Analog, Analog-Digital
net LINEINL uses Analog, Analog-Digital
net LINEOUTR uses Analog, Analog-Digital
net LINEOUTL uses Analog, Analog-Digital
net D02 uses Analog-Digital, Digital
net D00 uses Analog-Digital, Digital
net D01 uses Analog-Digital, Digital
net D03 uses Analog-Digital, Digital
net D04 uses Analog-Digital, Digital
net D05 uses Analog-Digital, Digital
net D06 uses Analog-Digital, Digital
net D07 uses Analog-Digital, Digital
net D08 uses Analog-Digital, Digital
net D09 uses Analog-Digital, Digital
net D10 uses Analog-Digital, Digital
net D11 uses Analog-Digital, Digital
net D12 uses Analog-Digital, Digital
net D13 uses Analog-Digital, Digital
net D14 uses Analog-Digital, Digital
net 3V3A uses Analog, Analog-Digital
net D26 uses Analog-Digital, Digital
net D27 uses Analog-Digital, Digital
net D29 uses Analog-Digital, Digital
net D30 uses Analog-Digital, Digital
net 3V3D uses Analog-Digital, Digital
net A00 uses Analog, Analog-Digital
net A01 uses Analog, Analog-Digital
net A02 uses Analog, Analog-Digital
net A03 uses Analog, Analog-Digital
net A04 uses Analog, Analog-Digital
net A05 uses Analog, Analog-Digital
net A06 uses Analog, Analog-Digital
net A07 uses Analog, Analog-Digital
net A08 uses Analog, Analog-Digital
net A09 uses Analog, Analog-Digital
net A10 uses Analog, Analog-Digital
net A11 uses Analog, Analog-Digital
net LINEOUTLDIRECT uses Analog, Analog-Digital
net LINEOUTLAMP uses Analog, Analog-Digital
net LINEOUTRDIRECT uses Analog, Analog-Digital
net 5VMCU uses Voltage
net LINEOUTRAMP uses Analog, Analog-Digital
net 5VAMPIN uses Voltage
net 5VAMPOUT uses Voltage
net INSINAMP uses Analog, Analog-Digital
net INSINFINAL uses Analog, Analog-Digital
net INSIN uses Analog, Analog-Digital
net 5VUNREG2 uses Voltage
net 5VUNREG3 uses Voltage
net 5VUNREG1 uses Voltage
net AC2 uses AC
net AC1 uses AC
net 5VNOISEY2 uses Voltage
net 5VNOISEY3 uses Voltage
net 5VNOISEY1 uses Voltage
net 5VNOISEY4 uses Voltage
['net class', 'analogs'] ['NET_CLASS', 'Digitals'] uses Analog-Digital

## Placement (name value [footprint] x y rotation side)
C5  1uF  [CAP-TH_L8.0-W4.0-P5.00-D0.7]  8.5 39.5 0 top
C21  1uF  [CAP-TH_L8.0-W4.0-P5.00-D0.7]  20 60 0 top
C25  1uF  [CAP-TH_L8.0-W4.0-P5.00-D0.7]  90.5 60 0 top
C27  100nF  [CAP-TH_L8.0-W4.0-P5.00-D0.7]  157 56 270 top
C33  100nF  [CAP-TH_L8.0-W4.0-P5.00-D0.7]  23 45 270 top
C34  3.3nF  [CAP-TH_L8.0-W4.0-P5.00-D0.7]  158.58 10.81 0 top
C36  3.3nF  [CAP-TH_L8.0-W4.0-P5.00-D0.7]  158.58 13.31 0 top
C37  3.3nF  [CAP-TH_L8.0-W4.0-P5.00-D0.7]  158.58 15.81 0 top
C38  3.3nF  [CAP-TH_L8.0-W4.0-P5.00-D0.7]  158.58 18.31 0 top
C39  3.3nF  [CAP-TH_L8.0-W4.0-P5.00-D0.7]  158.58 20.81 0 top
C40  3.3nF  [CAP-TH_L8.0-W4.0-P5.00-D0.7]  158.58 23.31 0 top
C41  3.3nF  [CAP-TH_L8.0-W4.0-P5.00-D0.7]  158.58 25.81 180 top
C42  3.3nF  [CAP-TH_L8.0-W4.0-P5.00-D0.7]  158.58 28.31 0 top
C43  3.3nF  [CAP-TH_L8.0-W4.0-P5.00-D0.7]  158.58 30.81 180 top
C44  3.3nF  [CAP-TH_L8.0-W4.0-P5.00-D0.7]  158.58 33.31 180 top
C45  3.3nF  [CAP-TH_L8.0-W4.0-P5.00-D0.7]  158.58 35.81 180 top
C46  3.3nF  [CAP-TH_L8.0-W4.0-P5.00-D0.7]  158.44 43.82 180 top
C47  1uF  [CAP-TH_L8.0-W4.0-P5.00-D0.7]  87 40 180 top
C50  1uF  [CAP-TH_L8.0-W4.0-P5.00-D0.7]  87 23 180 top
C53  1uF  [CAP-TH_L8.0-W4.0-P5.00-D0.7]  60 60 0 top
C55  100nF  [CAP-TH_L8.0-W4.0-P5.00-D0.7]  73 44 270 top
C56  1uF  [CAP-TH_L8.0-W4.0-P5.00-D0.7]  57 40 0 top
C57  1uF  [CAP-TH_L8.0-W4.0-P5.00-D0.7]  57 23 0 top
C59  100nF  [CAP-TH_L8.0-W4.0-P5.00-D0.7]  346.13 17.38 270 top
C62  47uF  [CAP-TH_BD5.0-P2.00-D0.5-FD]  341.13 17.38 90 top
C63  10uF  [CAP-TH_BD5.0-P2.00-D0.5-FD-1]  335.63 17.38 90 top
C64  100nF  [CAP-TH_L8.0-W4.0-P5.00-D0.7]  327.63 17.38 90 top
C65  10uF  [CAP-TH_BD5.0-P2.00-D0.5-FD-1]  327.63 7.38 90 top
C66  10uF  [CAP-TH_BD5.0-P2.00-D0.5-FD-1]  8.5 25.5 180 top
C67  10uF  [CAP-TH_BD5.0-P2.00-D0.5-FD-1]  107 21 270 top
C68  10uF  [CAP-TH_BD5.0-P2.00-D0.5-FD-1]  162 57.5 90 top
C69  10uF  [CAP-TH_BD5.0-P2.00-D0.5-FD-1]  107 54 270 top
CN2  Instrument Input  [AUDIO-TH_CK6.35-3-15-6]  20 85 270 top
CN3  Line Output L  [AUDIO-TH_CK6.35-3-15-6]  90 85 270 top
CN4  Line Output R  [AUDIO-TH_CK6.35-3-15-6]  60 85 270 top
CN5  Instrument Level Output L  [AUDIO-TH_CK6.35-3-15-6]  190 85 270 top
CN6  Instrument Level Output R  [AUDIO-TH_CK6.35-3-15-6]  160 85 270 top
D4  1N5817  [DO-41_BD2.4-L4.7-P8.70-D0.9-RD]  346.13 7.38 270 top
F1  PTC PolySwitch 1A  [FUSE-TH_BD2.1-L6.5_V0]  321 14 90 top
FH1  1A Fuse  [FUSE-TH_L24.8-W9.8-P22.60]  328 82 270 top
H6  Direct/Amp In  [HDR-TH_3P-P2.54-V-M-1]  20 67 180 top
H7  Direct/Amp Out L  [HDR-TH_3P-P2.54-V-M-1]  90.5 67 0 top
H8  RIN/LIN  [HDR-TH_3P-P2.54-V-M-1]  20 20 180 top
H9  Amp Out L  [HDR-TH_2P-P2.00-V-M]  87 19 180 top
H10  Direct/Amp Out R  [HDR-TH_3P-P2.54-V-M-1]  60 67 0 top
H11  Amp Out R  [HDR-TH_2P-P2.00-V-M]  57 19 0 top
H12  Amp Instrument  [HDR-TH_2P-P2.00-V-M]  20 24.5 0 top
J1  Expression Pedal  [AUDIO-TH_PJ-609BA]  230 85 270 top
J3  Line Output  [AUDIO-TH_PJ-609BA]  120 85 270 top
J4  Control Board 2  [HDR-TH_20P-P2.54-V-M-1]  189 32 90 top
R3  100K  [PS-RES-16.5*6.42]  8.5 32.5 180 top
R4  1K  [PS-RES-16.5*6.42]  8.5 35.5 180 top
R5  100K  [PS-RES-16.5*6.42]  8.5 29.5 0 top
R19  2.2K  [PS-RES-16.5*6.42]  179.24 10.28 0 top
R20  2.2K  [PS-RES-16.5*6.42]  179.24 12.78 0 top
R21  2.2K  [PS-RES-16.5*6.42]  179.24 15.28 0 top
R22  2.2K  [PS-RES-16.5*6.42]  179.24 17.78 0 top
R23  2.2K  [PS-RES-16.5*6.42]  179.24 20.28 0 top
R24  2.2K  [PS-RES-16.5*6.42]  179.24 22.78 0 top
R25  2.2K  [PS-RES-16.5*6.42]  179.24 25.78 0 top
R26  2.2K  [PS-RES-16.5*6.42]  179.24 28.28 0 top
R27  2.2K  [PS-RES-16.5*6.42]  179.24 30.78 0 top
R28  2.2K  [PS-RES-16.5*6.42]  179.24 33.28 0 top
R29  2.2K  [PS-RES-16.5*6.42]  179.24 35.78 0 top
R30  2.2K  [PS-RES-16.5*6.42]  179.15 43.84 0 top
R31  100K  [PS-RES-16.5*6.42]  87 36 180 top
R32  100R  [PS-RES-16.5*6.42]  87 33 180 top
R33  100K  [PS-RES-16.5*6.42]  87 30 180 top
R34  100K  [PS-RES-16.5*6.42]  87 27 180 top
R38  10K  [PS-RES-16.5*6.42]  176.34 76.69 90 top
R39  1K  [PS-RES-16.5*6.42]  176.34 87.69 90 top
R40  10K  [PS-RES-16.5*6.42]  146.11 76.72 90 top
R41  1K  [PS-RES-16.5*6.42]  146.11 87.72 90 top
R42  100K  [PS-RES-16.5*6.42]  57 36 0 top
R43  100R  [PS-RES-16.5*6.42]  57 33 0 top
R44  100K  [PS-RES-16.5*6.42]  57 30 0 top
R45  100K  [PS-RES-16.5*6.42]  57 27 0 top
U2  Daisy Seed  [DAISY_SEED]  144.53 33.58 180 top
U5  Ferrite Bead 600Rat100MHz  [IND-TH_BD3.5-L6.0-P10.00-D0.8]  163 64 0 top
U7  Control Board 1  [HDR-TH_16P-P2.54-V-M_1]  122.72 37.71 270 top
U16  5V MCU  [HDR-TH_2P-P2.54-V-M-1]  152 63 90 top
U17  5V Amp In  [HDR-TH_2P-P2.54-V-M-1]  27 45 270 top
U18  5V Amp Out  [HDR-TH_2P-P2.54-V-M-1]  77 44 270 top
U19  TLV2462  [PDIP-8_L9.5-W6.4-P2.54-LS7.6-BL]  75 32 270 top
U21  TLV2462  [PDIP-8_L9.5-W6.4-P2.54-LS7.6-BL]  20 32 270 top
U22  IRM-05-5  [PWRM-TH_IRM-05-5]  332 46 270 top
U24  LM7805T  [TO-220-3_L10.0-W4.5-P2.54-L-1]  335.63 7.38 90 top
U25  Ferrite Bead 600Rat100MHz  [IND-TH_BD3.5-L6.0-P10.00-D0.8]  341.13 7.38 90 top
U26  AC  [CONN-TH_P5.08_KF128-5.08-2P]  344 89 180 top
U27  Ferrite Bead 600Rat100MHz  [IND-TH_BD3.5-L6.0-P10.00-D0.8]  112 21 270 top
U29  Ferrite Bead 600Rat100MHz  [IND-TH_BD3.5-L6.0-P10.00-D0.8]  112 54 270 top

## Footprints (pads in the part's own frame, mm; a bottom-side part is the same pattern mirrored in y, then rotated)
AUDIO-TH_CK6.35-3-15-6
  oval 2.5x1.8 hole 1.8x1.1: 1(-6.3,-8.25) 2(-6.3,8.25) 3(6.3,-8.25) 4(6.3,8.25)
AUDIO-TH_PJ-609BA
  oval 3.2x1.6 hole 2.1x0.8: 2(-6.3,-8.1) 4(0,-8.1) 6(6.3,-8.1)
  oval 3.2x1.6 hole 2.4x0.8: 3(-6.3,8.1) 5(0,8.1) 7(6.3,8.1)
CAP-TH_BD5.0-P2.00-D0.5-FD
  round 1.1 hole 0.7: 1(-1,0) 2(1,0)
CAP-TH_BD5.0-P2.00-D0.5-FD-1
  round 1.1 hole 0.7: 1(-1,0) 2(1,0)
CAP-TH_L8.0-W4.0-P5.00-D0.7
  round 1.8 hole 1: 1(-2.5,0) 2(2.5,0)
CONN-TH_P5.08_KF128-5.08-2P
  round 2.4 hole 1.6: 1(-2.54,0) 2(2.54,0)
DAISY_SEED
  round 1.6 hole 0.914: 1(7.62,-22.86) 2(7.62,-20.32) 3(7.62,-17.78) 4(7.62,-15.24) 5(7.62,-12.7) 6(7.62,-10.16) 7(7.62,-7.62) 8(7.62,-5.08) 9(7.62,-2.54) 10(7.62,0) 11(7.62,2.54) 12(7.62,5.08) 13(7.62,7.62) 14(7.62,10.16) 15(7.62,12.7) 16(7.62,15.24) 17(7.62,17.78) 18(7.62,20.32) 19(7.62,22.86) 20(7.62,25.4) 21(-7.62,25.4) 22(-7.62,22.86) 23(-7.62,20.32) 24(-7.62,17.78) 25(-7.62,15.24) 26(-7.62,12.7) 27(-7.62,10.16) 28(-7.62,7.62) 29(-7.62,5.08) 30(-7.62,2.54) 31(-7.62,0) 32(-7.62,-2.54) 33(-7.62,-5.08) 34(-7.62,-7.62) 35(-7.62,-10.16) 36(-7.62,-12.7) 37(-7.62,-15.24) 38(-7.62,-17.78) 39(-7.62,-20.32) 40(-7.62,-22.86)
DO-41_BD2.4-L4.7-P8.70-D0.9-RD
  round 1.8 hole 1: 1(-4.35,0) 2(4.35,0)
FUSE-TH_BD2.1-L6.5_V0
  round 1.5 hole 0.8: 1(-5.08,0) 2(5.08,0)
FUSE-TH_L24.8-W9.8-P22.60
  round 3 hole 2: 1(-11.3,0) 2(11.3,0)
HDR-TH_2P-P2.00-V-M
  rect 1.4x1.4 hole 0.9: 1(-1,0)
  round 1.4 hole 0.9: 2(1,0)
HDR-TH_2P-P2.54-V-M-1
  rect 1.8x1.8 hole 1.1: 1(-1.27,0)
  round 1.8 hole 1.1: 2(1.27,0)
HDR-TH_3P-P2.54-V-M-1
  rect 1.575x1.8 hole 1.2: 1(-2.54,0)
  round 1.8 hole 1.2: 2(0,0) 3(2.54,0)
HDR-TH_16P-P2.54-V-M_1
  rect 1.45x1.45 hole 0.85: 1(-19.05,0)
  round 1.45 hole 0.85: 2(-16.51,0) 3(-13.97,0) 4(-11.43,0) 5(-8.89,0) 6(-6.35,0) 7(-3.81,0) 8(-1.27,0) 9(1.27,0) 10(3.81,0) 11(6.35,0) 12(8.89,0) 13(11.43,0) 14(13.97,0) 15(16.51,0) 16(19.05,0)
HDR-TH_20P-P2.54-V-M-1
  rect 1.8x1.8 hole 1.2: 1(-24.13,0)
  round 1.8 hole 1.2: 2(-21.59,0) 3(-19.05,0) 4(-16.51,0) 5(-13.97,0) 6(-11.43,0) 7(-8.89,0) 8(-6.35,0) 9(-3.81,0) 10(-1.27,0) 11(1.27,0) 12(3.81,0) 13(6.35,0) 14(8.89,0) 15(11.43,0) 16(13.97,0) 17(16.51,0) 18(19.05,0) 19(21.59,0) 20(24.13,0)
IND-TH_BD3.5-L6.0-P10.00-D0.8
  round 1.6 hole 1: 1(-5,0) 2(5,0)
PDIP-8_L9.5-W6.4-P2.54-LS7.6-BL
  rect 1.8x1.8 hole 1: 1(-3.81,-3.81)
  round 1.8 hole 1: 2(-1.27,-3.81) 3(1.27,-3.81) 4(3.81,-3.81) 5(3.81,3.81) 6(1.27,3.81) 7(-1.27,3.81) 8(-3.81,3.81)
PS-RES-16.5*6.42
  round 2 hole 1.2: 1(-3.749,0) 2(3.749,0)
PWRM-TH_IRM-05-5
  round 2.2 hole 1.5: 1(-19.25,-5.375) 2(-19.25,5.375) 3(19.25,2.625) 4(19.25,-5.375)
TO-220-3_L10.0-W4.5-P2.54-L-1
  rect 1.8x2.6 hole 1.2: 1(-2.54,0.005)
  oval 1.8x2.6 hole 1.2: 2(0,0.005) 3(2.54,-0.005)

## Nets
As in the schematic.

Pads without a net: CN2 2; CN3 2 4; CN4 2 4; CN5 2 4; CN6 2 4; J1 3 5; J3 3 5 7; U21 5 6 7

## Copper pours and planes (outline as drawn; the poured copper is in the pictures)
AGND on Bottom Layer: 0,95 350,95 350,0 0,0

## Text on the board
Bottom Layer: BOTTOM
Top Layer: TOP
Top Silkscreen Layer: D00 / D01 / D02 / D03 / D04 / D05 / D06 / D07 / D08 / D09 / D10 / D11 / D12 / D13 / D14 / GND | 3V3D / D30 / D29 / A11 / D27 / D26 / A10 / A9 / A8 / A7 / A6 / A5 / A4 / A3 / A2 / A1 / A0 / 3V3A
